# EAGLE design USB4x3HUB (EAGLE 7.5.0)

## Sheet 1 of 2: main
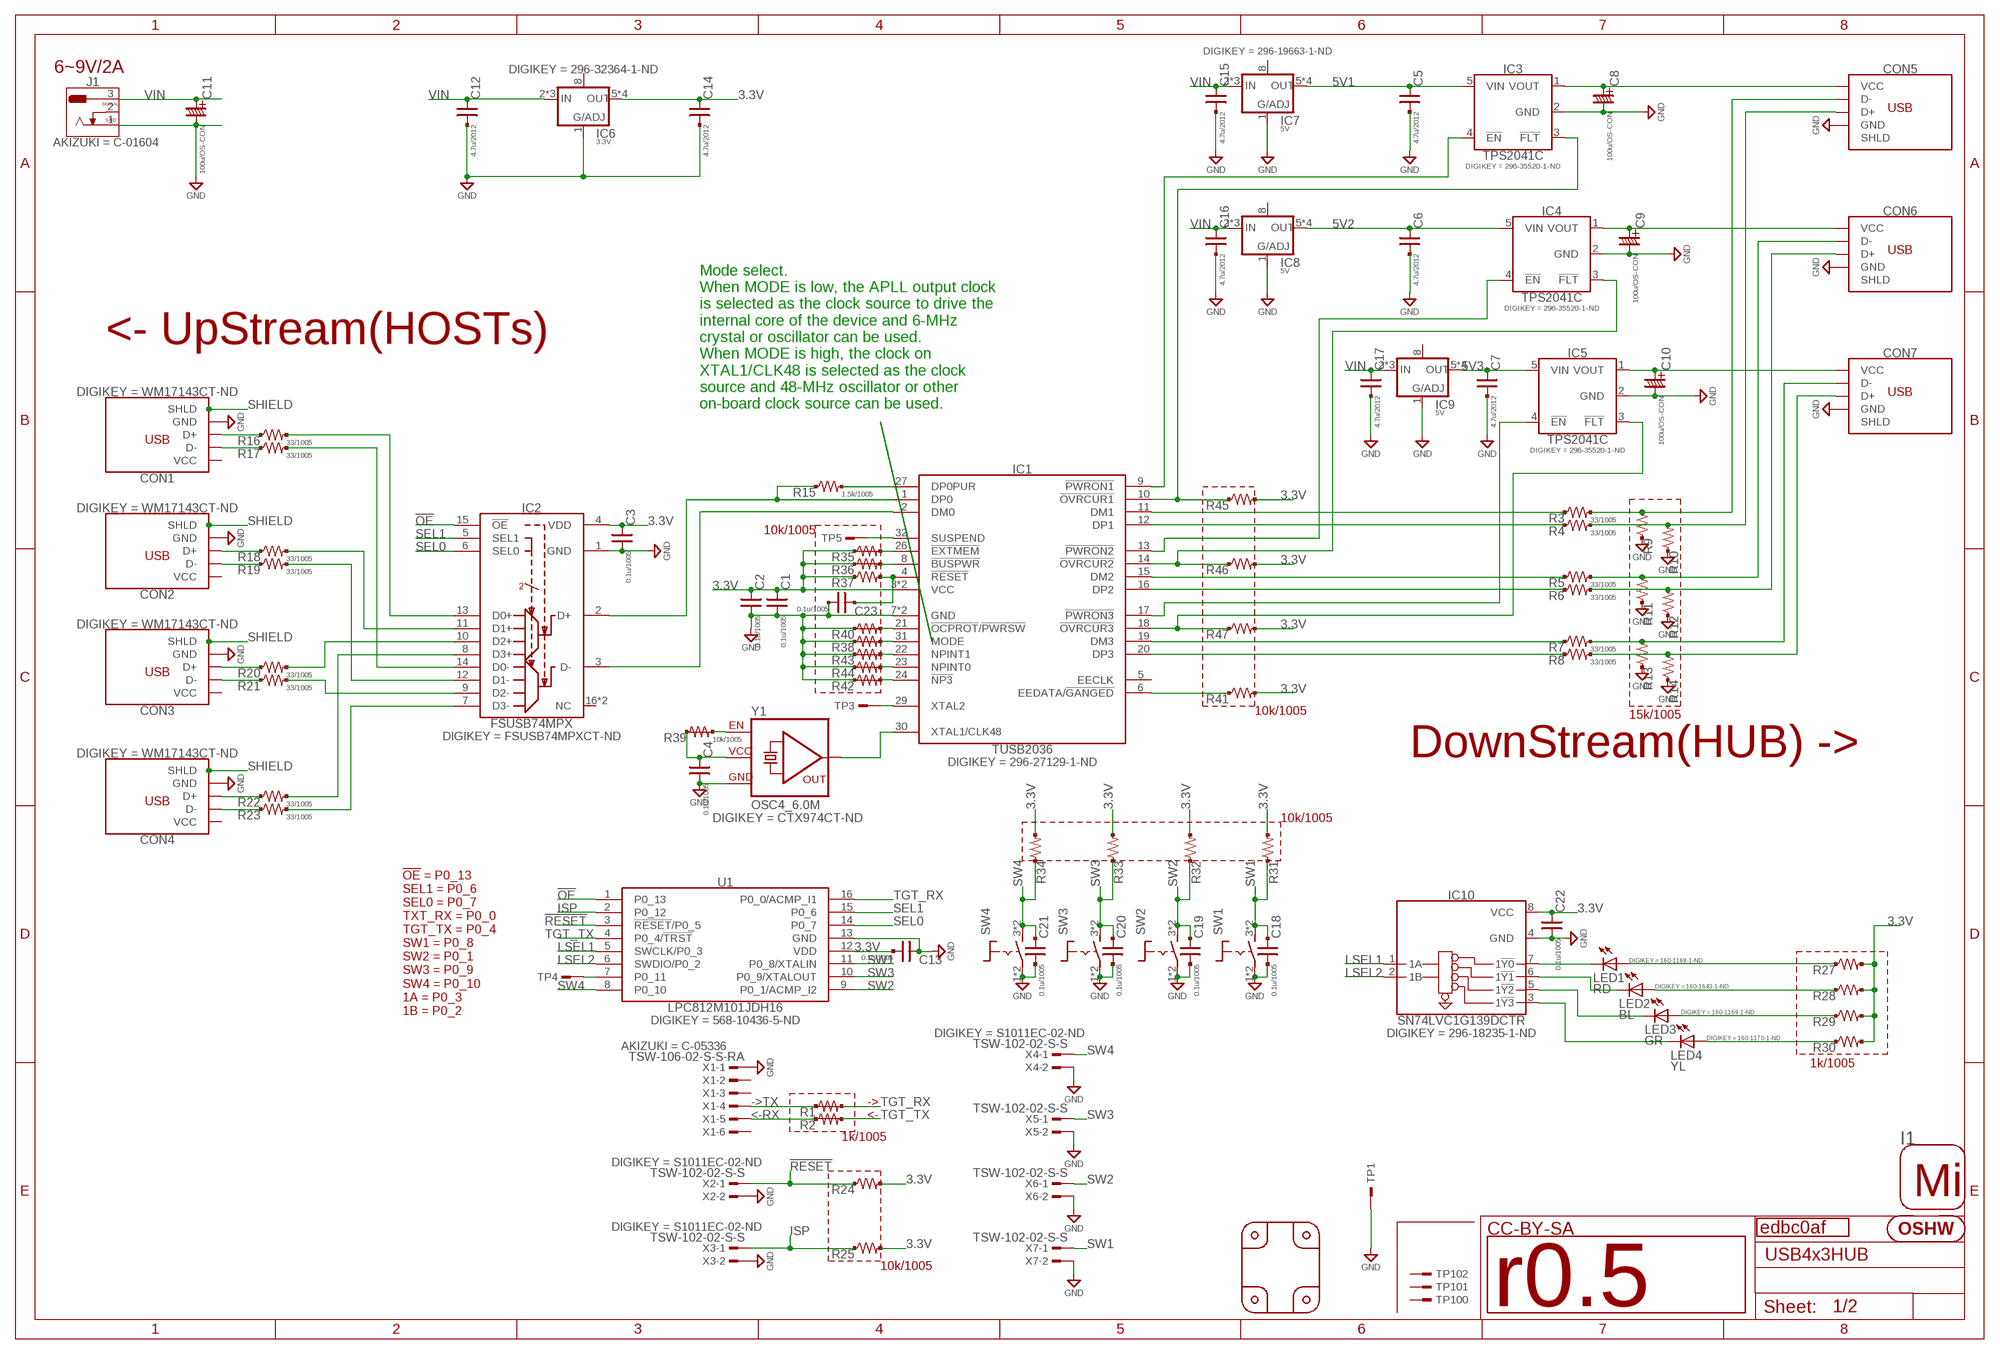
[diagram p0: schematic, sheet 1]

### Parts
C1  0.1u/1005  C_SMD_0.1U_1005  [C0402]
C2  0.1u/1005  C_SMD_0.1U_1005  [C0402]
C3  0.1u/1005  C_SMD_0.1U_1005  [C0402]
C4  0.1u/1005  C_SMD_0.1U_1005  [C0402]
C5  4.7u/2012  C_SMD_4.7U_2012  [CR_2125]
C6  4.7u/2012  C_SMD_4.7U_2012  [CR_2125]
C7  4.7u/2012  C_SMD_4.7U_2012  [CR_2125]
C8  100u/OS-CON  C_DENKAI_100U_875105142005WURTH  [C_2.5PHI5_875105142005WURTH]
C9  100u/OS-CON  C_DENKAI_100U_875105142005WURTH  [C_2.5PHI5_875105142005WURTH]
C10  100u/OS-CON  C_DENKAI_100U_875105142005WURTH  [C_2.5PHI5_875105142005WURTH]
C11  100u/OS-CON  C_DENKAI_100U_2.5P6.3_C6  [C_2.5PHI6.3_C6]
C12  4.7u/2012  C_SMD_4.7U_2012  [CR_2125]
C13  0.1u/1005  C_SMD_0.1U_1005  [C0402]
C14  4.7u/2012  C_SMD_4.7U_2012  [CR_2125]
C15  4.7u/2012  C_SMD_4.7U_2012  [CR_2125]
C16  4.7u/2012  C_SMD_4.7U_2012  [CR_2125]
C17  4.7u/2012  C_SMD_4.7U_2012  [CR_2125]
C18  0.1u/1005  C_SMD_0.1U_1005  [C0402]
C19  0.1u/1005  C_SMD_0.1U_1005  [C0402]
C20  0.1u/1005  C_SMD_0.1U_1005  [C0402]
C21  0.1u/1005  C_SMD_0.1U_1005  [C0402]
C22  0.1u/1005  C_SMD_0.1U_1005  [C0402]
C23  0.1u/1005  C_SMD_0.1U_1005  [C0402]
CON1  CON_USB_UB  [CON_USB_47589-0001MOLEX]
CON2  CON_USB_UB  [CON_USB_47589-0001MOLEX]
CON3  CON_USB_UB  [CON_USB_47589-0001MOLEX]
CON4  CON_USB_UB  [CON_USB_47589-0001MOLEX]
CON5  CON_USB_A_614104150121  [CON_USB_614104150121WURTH]
CON6  CON_USB_A_614104150121  [CON_USB_614104150121WURTH]
CON7  CON_USB_A_614104150121  [CON_USB_614104150121WURTH]
GIT1  edbc0af  GIT-REVISION_1.0  [GIT-REVISION]
I1  ICON_MINLAB_5.2S  [ICON_MINLAB_5.2MM]
IC1  TUSB2036  IC_USB_TUSB2036  [QFP32_0.8P7.2X7.2]
IC2  FSUSB74MPX  IC_USB_FSUSB74  [QFN16_0.5P3.0X3.0]
IC3  TPS2041C  IC_POWER_TPS2041C  [IC_05_0.95_50MIL]
IC4  TPS2041C  IC_POWER_TPS2041C  [IC_05_0.95_50MIL]
IC5  TPS2041C  IC_POWER_TPS2041C  [IC_05_0.95_50MIL]
IC6  3.3V  LDO4_3.3_DRJ  [DFN80P410X410_8N]
IC7  5V  LDO4_5.0_DRJ  [DFN80P410X410_8N]
IC8  5V  LDO4_5.0_DRJ  [DFN80P410X410_8N]
IC9  5V  LDO4_5.0_DRJ  [DFN80P410X410_8N]
IC10  SN74LVC1G139DCTR  IC_TTL_SINGLE_74_139_FLAT  [SOT65P315X290-8N]
ICON1  OSHW  ICON_OSHW  [ICON_OSHW]
ICON2  r0.5  ICON_REVISION_2.0  [ICON_REVISION2.0]
J1  CON_DCJACK_C1604  [CON_DCJACK_C-1604]
LED1  RD  LEDRDCHIPLED_0805  [CHIPLED_0805]
LED2  BL  LEDBLCHIPLED_0805  [CHIPLED_0805]
LED3  GR  LEDGRCHIPLED_0805  [CHIPLED_0805]
LED4  YL  LEDYLCHIPLED_0805  [CHIPLED_0805]
P1  PCB_CORNER  [PCB_CORNER]
P2  PCB_CORNER  [PCB_CORNER]
P3  PCB_CORNER  [PCB_CORNER]
P4  PCB_CORNER  [PCB_CORNER]
R1  R_US__1005SHORT  [R0402SHORT]
R2  R_US__1005SHORT  [R0402SHORT]
R3  33/1005  R_US_33R_1005  [C0402]
R4  33/1005  R_US_33R_1005  [C0402]
R5  33/1005  R_US_33R_1005  [C0402]
R6  33/1005  R_US_33R_1005  [C0402]
R7  33/1005  R_US_33R_1005  [C0402]
R8  33/1005  R_US_33R_1005  [C0402]
R9  15k/1005  R_US_15K_1005  [C0402]
R10  15k/1005  R_US_15K_1005  [C0402]
R11  15k/1005  R_US_15K_1005  [C0402]
R12  15k/1005  R_US_15K_1005  [C0402]
R13  15k/1005  R_US_15K_1005  [C0402]
R14  15k/1005  R_US_15K_1005  [C0402]
R15  1.5k/1005  R_US_1.5K_1005  [C0402]
R16  33/1005  R_US_33R_1005  [C0402]
R17  33/1005  R_US_33R_1005  [C0402]
R18  33/1005  R_US_33R_1005  [C0402]
R19  33/1005  R_US_33R_1005  [C0402]
R20  33/1005  R_US_33R_1005  [C0402]
R21  33/1005  R_US_33R_1005  [C0402]
R22  33/1005  R_US_33R_1005  [C0402]
R23  33/1005  R_US_33R_1005  [C0402]
R24  10k/1005  R_US_10K_1005  [C0402]
R25  10k/1005  R_US_10K_1005  [C0402]
R27  1k/1005  R_US_1.0K_1005  [C0402]
R28  1k/1005  R_US_1.0K_1005  [C0402]
R29  1k/1005  R_US_1.0K_1005  [C0402]
R30  1k/1005  R_US_1.0K_1005  [C0402]
R31  10k/1005  R_US_10K_1005  [C0402]
R32  10k/1005  R_US_10K_1005  [C0402]
R33  10k/1005  R_US_10K_1005  [C0402]
R34  10k/1005  R_US_10K_1005  [C0402]
R35  R_US__1005SHORT  [R0402SHORT]
R36  R_US__1005SHORT  [R0402SHORT]
R37  10k/1005  R_US_10K_1005  [C0402]
R38  R_US__1005SHORT  [R0402SHORT]
R39  10k/1005  R_US__1005SHORT  [R0402SHORT]
R40  R_US__1005SHORT  [R0402SHORT]
R41  10k/1005  R_US_10K_1005  [C0402]
R42  R_US__1005SHORT  [R0402SHORT]
R43  R_US__1005SHORT  [R0402SHORT]
R44  R_US__1005SHORT  [R0402SHORT]
R45  10k/1005  R_US_10K_1005  [C0402]
R46  10k/1005  R_US_10K_1005  [C0402]
R47  10k/1005  R_US_10K_1005  [C0402]
SW1  TACTSW2_WH_SKRPACE010  [SW_TACTSW_SKRPACE010]
SW2  TACTSW2_WH_SKRPACE010  [SW_TACTSW_SKRPACE010]
SW3  TACTSW2_WH_SKRPACE010  [SW_TACTSW_SKRPACE010]
SW4  TACTSW2_WH_SKRPACE010  [SW_TACTSW_SKRPACE010]
TP1  TESTPAD_4020  [TP_4020]
TP3  TESTPAD  [TP06RECT]
TP4  TESTPAD  [TP06RECT]
TP5  TESTPAD  [TP06RECT]
TP100  TESTPAD_F  [FIDUCIAL]
TP101  TESTPAD_F  [FIDUCIAL]
TP102  TESTPAD_F  [FIDUCIAL]
U1  LPC812M101JDH16  IC_LPC81X_16_JDH16  [SOT65P510X450X110-16N]
X1  TSW-106-02-S-S-RA  [TSW-106-02-S-S-RA]
X2  TSW-102-02-S-S  [TSW-102-02-S-S]
X3  TSW-102-02-S-S  [TSW-102-02-S-S]
X4  TSW-102-02-S-S  [TSW-102-02-S-S]
X5  TSW-102-02-S-S  [TSW-102-02-S-S]
X6  TSW-102-02-S-S  [TSW-102-02-S-S]
X7  TSW-102-02-S-S  [TSW-102-02-S-S]
Y1  OSC4_6.0M  [CLOCK_2520]

### Nets
3.3V: C1.1 C2.1 C3.1 C4.1 C13.2 C14.1 C22.1 IC1.3(VCC) IC1.25(VCC) IC2.4(VDD) IC6.5(OUT) IC6.6(OUT) IC6.7(OUT) IC6.EP(OUT) IC10.8(VCC) R24.2 R25.2 R27.2 R28.2 R29.2 R30.2 R31.2 R32.2 R33.2 R34.2 R35.1 R35.2 R36.1 R36.2 R37.1 R39.1 R39.2 R41.2 R45.2 R46.2 R47.2 U1.12(VDD) Y1.4(VCC)
5V1: C5.1 IC3.5(VIN) IC7.5(OUT) IC7.6(OUT) IC7.7(OUT) IC7.EP(OUT)
5V2: C6.1 IC4.5(VIN) IC8.5(OUT) IC8.6(OUT) IC8.7(OUT) IC8.EP(OUT)
5V3: C7.1 IC5.5(VIN) IC9.5(OUT) IC9.6(OUT) IC9.7(OUT) IC9.EP(OUT)
!OE!: IC2.15(!OE!) U1.1(P0_13)
!RESET!: R24.1 U1.3(!RESET!/P0_5) X2.1
->TX: R1.1 R1.2 X1.4
<-RX: R2.1 R2.2 X1.5
GND: C1.2 C2.2 C3.2 C4.2 C5.2 C6.2 C7.2 C8.- C9.- C10.- C11.- C12.2 C13.1 C14.2 C15.2 C16.2 C17.2 C18.2 C19.2 C20.2 C21.2 C22.2 C23.2 CON1.5(GND) CON2.5(GND) CON3.5(GND) CON4.5(GND) CON5.4(GND) CON6.4(GND) CON7.4(GND) IC1.7(GND) IC1.28(GND) IC2.1(GND) IC3.2(GND) IC4.2(GND) IC5.2(GND) IC6.1(ADJ) IC7.1(ADJ) IC8.1(ADJ) IC9.1(ADJ) IC10.4(GND) J1.1 R9.1 R10.1 R11.1 R12.1 R13.1 R14.1 R38.1 R38.2 R40.1 R40.2 R42.1 R42.2 R43.1 R43.2 R44.1 R44.2 SW1.1(P) SW1.2(P) SW2.1(P) SW2.2(P) SW3.1(P) SW3.2(P) SW4.1(P) SW4.2(P) TP1.TP U1.13(GND) X1.1 X2.2 X3.2 X4.2 X5.2 X6.2 X7.2 Y1.2(GND)
ISP: R25.1 U1.2(P0_12) X3.1
LSEL1: IC10.1(1A) U1.5(SWCLK/P0_3)
LSEL2: IC10.2(1B) U1.6(SWDIO/P0_2)
N$1: IC1.1(DP0) IC2.2(D+) R15.1
N$2: IC1.2(DM0) IC2.3(D-)
N$3: CON1.3(D+) R16.1
N$4: CON1.2(D-) R17.1
N$5: CON2.3(D+) R18.1
N$6: CON2.2(D-) R19.1
N$7: CON3.3(D+) R20.1
N$8: CON4.3(D+) R22.1
N$9: CON3.2(D-) R21.1
N$10: CON4.2(D-) R23.1
N$11: C8.+ CON5.1(VCC) IC3.1(VOUT)
N$12: C9.+ CON6.1(VCC) IC4.1(VOUT)
N$13: C10.+ CON7.1(VCC) IC5.1(VOUT)
N$14: CON1.1(VCC)
N$15: IC1.30(XTAL1/CLK48) Y1.3(OUT)
N$16: IC1.10(!OVRCUR1!) IC3.3(!FLT!) R45.1
N$17: IC1.9(!PWRON1!) IC3.4(!EN!)
N$18: CON5.2(D-) R3.2 R9.2
N$19: CON5.3(D+) R4.2 R10.2
N$20: IC1.14(!OVRCUR2!) IC4.3(!FLT!) R46.1
N$21: IC1.13(!PWRON2!) IC4.4(!EN!)
N$22: CON6.2(D-) R5.2 R11.2
N$23: CON6.3(D+) R6.2 R12.2
N$24: IC1.17(!PWRON3!) IC5.4(!EN!)
N$25: IC1.18(!OVRCUR3!) IC5.3(!FLT!) R47.1
N$26: CON7.2(D-) R7.2 R13.2
N$27: CON7.3(D+) R8.2 R14.2
N$28: CON2.1(VCC)
N$29: CON3.1(VCC)
N$30: IC1.6(EEDATA/!GANGED!) R41.1
N$35: IC1.11(DM1) R3.1
N$36: IC1.12(DP1) R4.1
N$37: IC1.15(DM2) R5.1
N$38: IC1.16(DP2) R6.1
N$39: IC1.19(DM3) R7.1
N$40: IC1.20(DP3) R8.1
N$41: IC1.27(DP0PUR) R15.2
N$42: IC2.13(D0+) R16.2
N$43: IC2.11(D1+) R18.2
N$44: IC2.10(D2+) R20.2
N$45: IC2.8(D3+) R22.2
N$46: IC2.14(D0-) R17.2
N$47: IC2.12(D1-) R19.2
N$48: IC2.9(D2-) R21.2
N$49: IC2.7(D3-) R23.2
N$50: IC1.32(SUSPEND) TP5.TP
N$51: IC10.7(1!Y0!) LED1.C
N$52: IC10.6(1!Y1!) LED2.C
N$53: IC10.5(1!Y2!) LED3.C
N$54: IC10.3(1!Y3!) LED4.C
N$55: LED4.A R30.1
N$56: LED3.A R29.1
N$57: LED2.A R28.1
N$58: LED1.A R27.1
N$59: IC1.29(XTAL2) TP3.TP
N$60: IC1.26(!EXTMEM!) R35.3
N$61: IC1.8(!BUSPWR!) R36.3
N$62: C23.1 IC1.4(!RESET!) R37.2
N$63: IC1.21(!OCPROT!/!PWRSW!) R40.3
N$64: IC1.31(MODE) R38.3
N$65: IC1.22(NPINT1) R43.3
N$66: IC1.23(NPINT0) R44.3
N$67: IC1.24(!NP3!) R42.3
N$68: R39.3 Y1.1(C)
N$69: TP4.TP U1.7(P0_11)
SEL0: IC2.6(SEL0) U1.14(P0_7)
SEL1: IC2.5(SEL1) U1.15(P0_6)
SHIELD: CON1.SHD$1(SHLD) CON1.SHD$2(SHLD) CON1.SHD$3(SHLD) CON1.SHD$4(SHLD) CON1.SHD$5(SHLD) CON1.SHD$6(SHLD) CON1.SHD$7(SHLD) CON1.SHD(SHLD) CON2.SHD$1(SHLD) CON2.SHD$2(SHLD) CON2.SHD$3(SHLD) CON2.SHD$4(SHLD) CON2.SHD$5(SHLD) CON2.SHD$6(SHLD) CON2.SHD$7(SHLD) CON2.SHD(SHLD) CON3.SHD$1(SHLD) CON3.SHD$2(SHLD) CON3.SHD$3(SHLD) CON3.SHD$4(SHLD) CON3.SHD$5(SHLD) CON3.SHD$6(SHLD) CON3.SHD$7(SHLD) CON3.SHD(SHLD) CON4.SHD$1(SHLD) CON4.SHD$2(SHLD) CON4.SHD$3(SHLD) CON4.SHD$4(SHLD) CON4.SHD$5(SHLD) CON4.SHD$6(SHLD) CON4.SHD$7(SHLD) CON4.SHD(SHLD)
SW1: C18.1 R31.1 SW1.3(S) SW1.4(S) U1.11(P0_8/XTALIN) X7.1
SW2: C19.1 R32.1 SW2.3(S) SW2.4(S) U1.9(P0_1/ACMP_I2) X6.1
SW3: C20.1 R33.1 SW3.3(S) SW3.4(S) U1.10(P0_9/XTALOUT) X5.1
SW4: C21.1 R34.1 SW4.3(S) SW4.4(S) U1.8(P0_10) X4.1
TGT_RX: R1.3 U1.16(P0_0/ACMP_I1)
TGT_TX: R2.3 U1.4(P0_4/!TRST!)
VIN: C11.+ C12.1 C15.1 C16.1 C17.1 IC6.2(IN) IC6.3(IN) IC6.4(IN) IC7.2(IN) IC7.3(IN) IC7.4(IN) IC8.2(IN) IC8.3(IN) IC8.4(IN) IC9.2(IN) IC9.3(IN) IC9.4(IN) J1.3
Unconnected: CON5.SHLD CON5.SHLD@1(SHLD) CON6.SHLD CON6.SHLD@1(SHLD) CON7.SHLD CON7.SHLD@1(SHLD) IC1.5(EECLK) IC2.16(NC) IC2.DP(NC) IC6.8(OUT/EN/NC) IC7.8(OUT/EN/NC) IC8.8(OUT/EN/NC) IC9.8(OUT/EN/NC) J1.2 TP100.TP TP101.TP TP102.TP X1.2 X1.3 X1.6

### Notes on the sheet
- 6~9V/2A
- <- UpStream(HOSTs)
- Mode select. 
  When MODE is low, the APLL output clock 
  is selected as the clock source to drive the
  internal core of the device and 6-MHz 
  crystal or oscillator can be used. 
  When MODE is high, the clock on 
  XTAL1/CLK48 is selected as the clock
  source and 48-MHz oscillator or other 
  on-board clock source can be used.
- 10k/1005
- 10k/1005
- 15k/1005
- DownStream(HUB) ->
- 10k/1005
- !OE! = P0_13
  SEL1 = P0_6
  SEL0 = P0_7
  TXT_RX = P0_0
  TGT_TX = P0_4
  SW1 = P0_8
  SW2 = P0_1
  SW3 = P0_9
  SW4 = P0_10
  1A = P0_3
  1B = P0_2
- 1k/1005
- ->
- <-
- 1k/1005
- CC-BY-SA
- 10k/1005

## Sheet 2 of 2
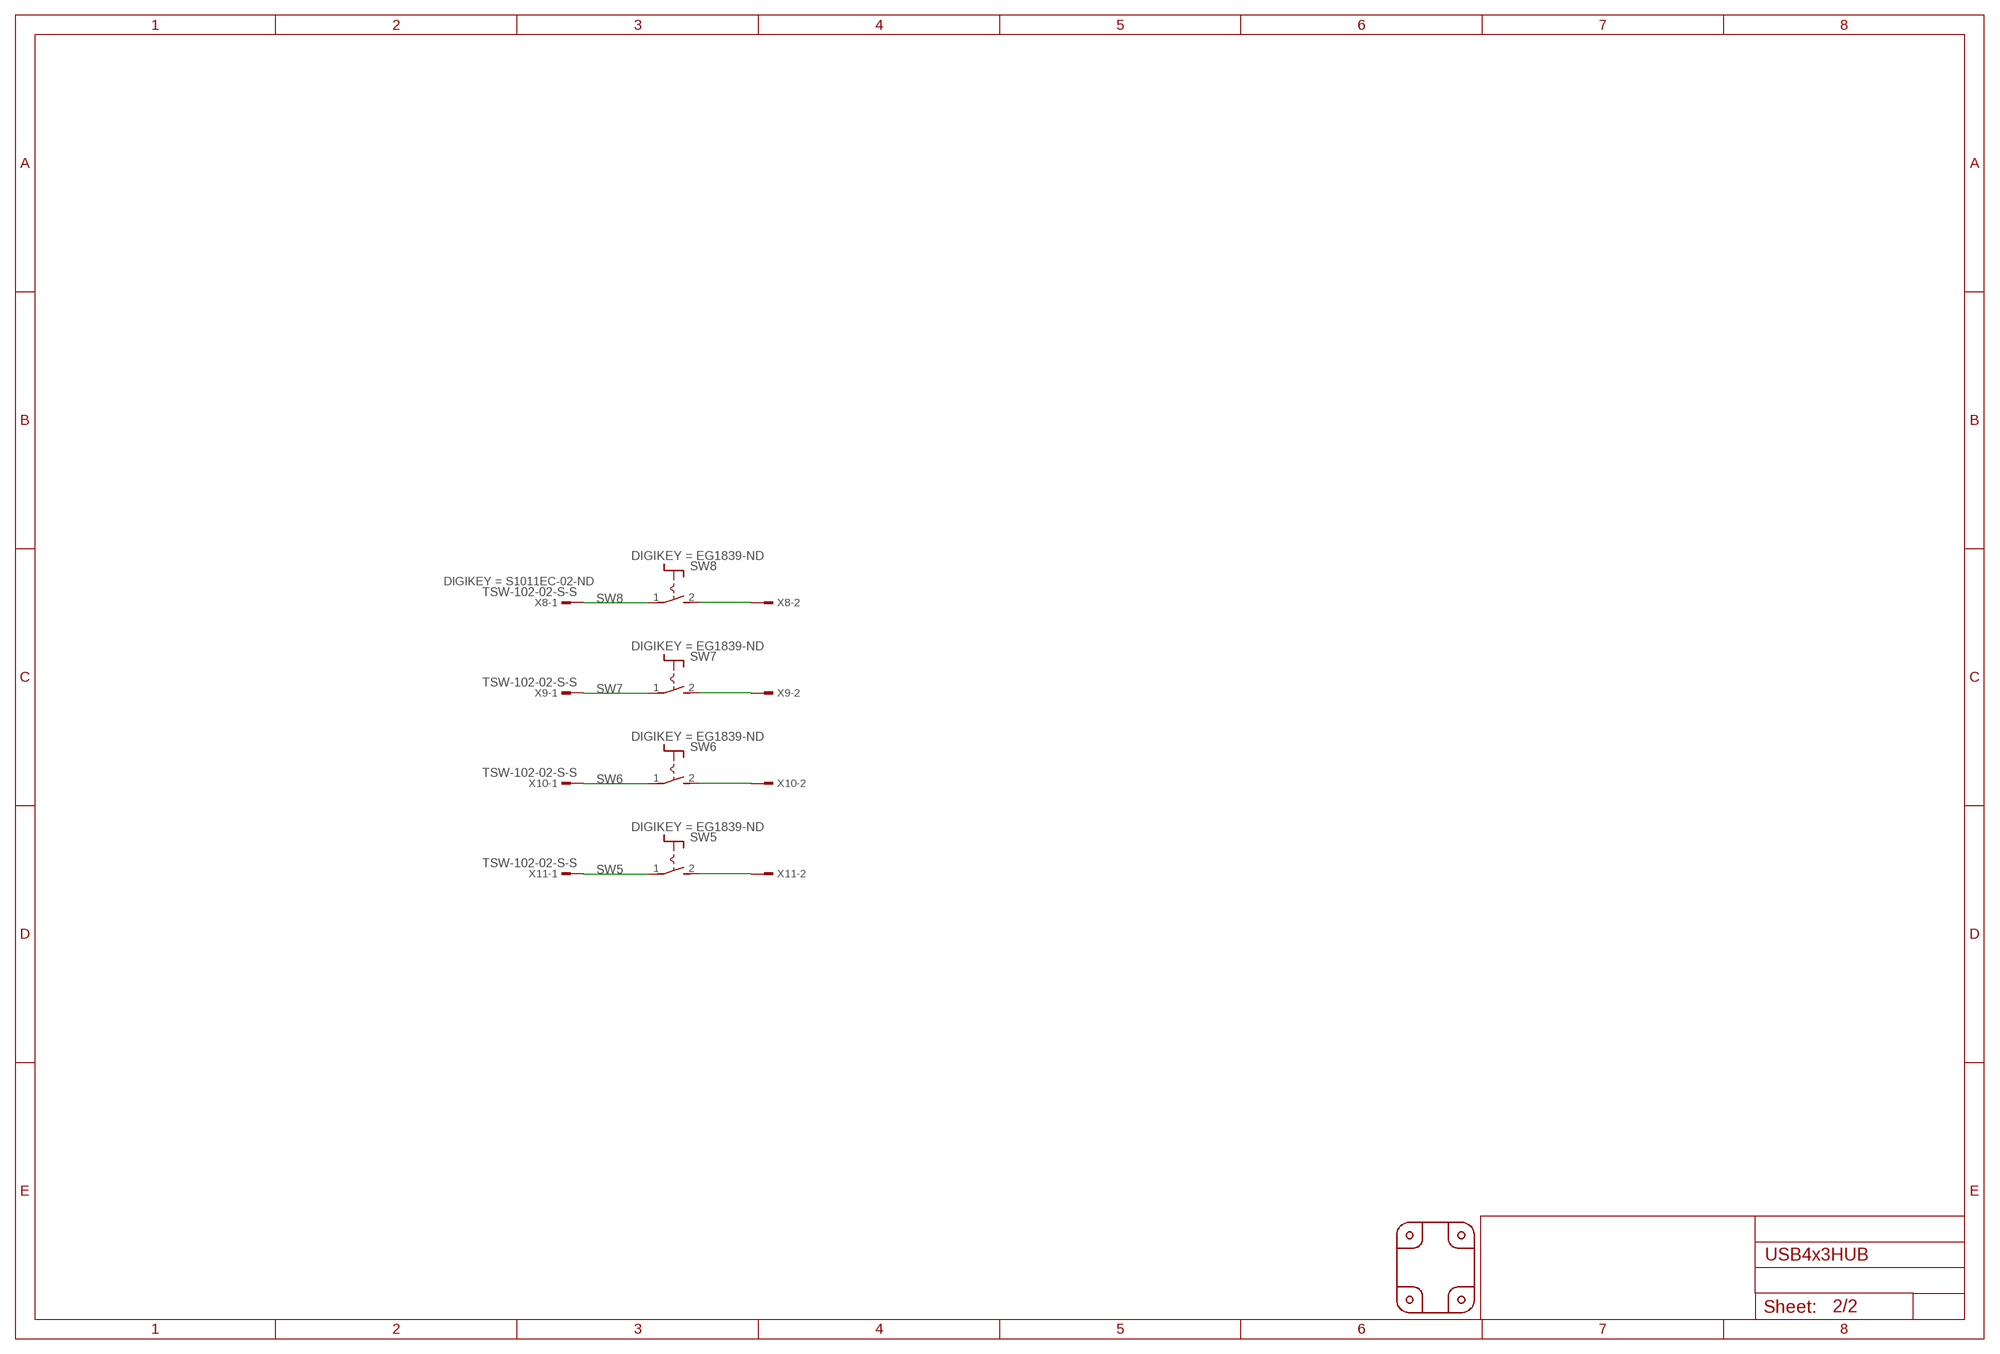
[diagram p1: schematic, sheet 2]

### Parts
P5  PCB_CORNER  [PCB_CORNER]
P6  PCB_CORNER  [PCB_CORNER]
P7  PCB_CORNER_NH  [PCB_CORNER_NH]
P8  PCB_CORNER_NH  [PCB_CORNER_NH]
SW5  TACTSW2_BK_TL1105S  [SW_TACTSW_TL1105S]
SW6  TACTSW2_BK_TL1105S  [SW_TACTSW_TL1105S]
SW7  TACTSW2_BK_TL1105S  [SW_TACTSW_TL1105S]
SW8  TACTSW2_BK_TL1105S  [SW_TACTSW_TL1105S]
X8  TSW-102-02-S-S  [TSW-102-02-S-S]
X9  TSW-102-02-S-S  [TSW-102-02-S-S]
X10  TSW-102-02-S-S  [TSW-102-02-S-S]
X11  TSW-102-02-S-S  [TSW-102-02-S-S]

### Nets
N$74: SW8.2(S) X8.2
N$75: SW7.2(S) X9.2
N$76: SW6.2(S) X10.2
N$77: SW5.2(S) X11.2
SW5: SW5.1(P) X11.1
SW6: SW6.1(P) X10.1
SW7: SW7.1(P) X9.1
SW8: SW8.1(P) X8.1

## Power pins joined to a net without a drawn wire
VCC: CON4.1(VCC)

## Library data of the parts
C1-C4 C13 C18-C23 = mylib:C_SMD_*: SMD CAPACITOR; DIGIKEY: 490-3261-1-ND; SEEED: 302010024; SMD_PAD: 2
C5-C7 C12 C14-C17 = mylib:C_SMD_*: SMD CAPACITOR; DIGIKEY: 490-9962-1-ND; SMD_PAD: 2
C8-C10 = mylib:C_DENKAI_*: Chemical capacitor; DIGIKEY: 732-6394-1-ND; SMD_PAD: 2
C11 = mylib:C_DENKAI_*: Chemical capacitor; DIGIKEY: P16468CT-ND; SMD_PAD: 2
CON1-CON4 = mylib:CON_USB: USB B CONNECTOR; DIGIKEY: WM17143CT-ND; SMD_PAD: 11
CON5-CON7 = mylib:CON_USB: USB B CONNECTOR; DIGIKEY: 732-5962-1-ND; MOUSER: 710-614104150121; TH_PAD: 6
GIT1 = git-revision:GIT-REVISION; NOT_COMPONENT: YES
I1 = mylib:ICON_MINLAB; NOT_COMPONENT: YES
IC1 = mylib:IC_USB_TUSB2036: 2/3-port USB hub IC; DIGIKEY: 296-27129-1-ND; SMD_PAD: 32
IC2 = mylib:IC_USB_FSUSB74: 4 to 1 USB switch; DIGIKEY: FSUSB74MPXCT-ND; SMD_PAD: 17
IC3-IC5 = mylib:IC_POWER_TPS2041C: power switch; DIGIKEY: 296-35520-1-ND; SMD_PAD: 5
IC6 = mylib:LDO4_*: LDO with 4 pins; DIGIKEY: 296-32364-1-ND; SMD_PAD: 9
IC7-IC9 = mylib:LDO4_*: LDO with 4 pins; DIGIKEY: 296-19663-1-ND; MOUSER: 595-TLV1117-50CDRJR; SMD_PAD: 9
IC10 = mylib:IC_TTL_SINGLE_74_139: single 74 logic IC: 139; DIGIKEY: 296-18235-1-ND; SMD_PAD: 8
ICON1 = mylib:ICON_OSHW: Silk icon of OSHW; NOT_COMPONENT: YES
ICON2 = mylib:ICON_REVISION; NOT_COMPONENT: YES
J1 = mylib:CON_DCJACK: DC JACK : 2.1 / 2.5 mm; AKIZUKI: C-01604; MOUSER: 163-179PH-EX; SEEED: 320120003; TH_PAD: 3
LED1 = led_local:LED: LED OSRAM: - CHIPLED LG R971, LG N971, LY N971, LG Q971, LY Q971, LO R971, LY R971 LH N974, LH R974 LS Q976, LO Q976, LY Q976 LO Q996 - Hyper CHIPLED LW Q18S LB Q993, LB Q99A, LB R99A - SideLED LS A670, LO A670, LY A670, LG A670, LP A670 LB A673, LV A673, LT A673, LW A673 LH A674 LY A675 LS A676, LA A676, LO A676, LY A676, LW A676 LS A679, LY A679, LG A679 - Hyper Micro SIDELED® LS Y876, LA Y876, LO Y876, LY Y876 LT Y87S - SmartLED LW L88C, LW L88S LB L89C, LB L89S, LG L890 LS L89K, LO L89K, LY L89K LS L896, LA L896, LO L896, LY L896 - TOPLED LS T670, LO T670, LY T670, LG T670, LP T670 LSG T670, LSP T670, LSY T670, LOP T670, LYG T670 LG T671, LOG T671, LSG T671 LB T673, LV T673, LT T673, LW T673 LH T674 LS T676, LA T676, LO T676, LY T676, LB T676, LH T676, LSB T676, LW T676 LB T67C, LV T67C, LT T67C, LS T67K, LO T67K, LY T67K, LW E67C LS E67B, LA E67B, LO E67B, LY E67B, LB E67C, LV E67C, LT E67C LW T67C LS T679, LY T679, LG T679 LS T770, LO T770, LY T770, LG T770, LP T770 LB T773, LV T773, LT T773, LW T773 LH T774 LS E675, LA E675, LY E675, LS T675 LS T776, LA T776, LO T776, LY T776, LB T776 LHGB T686 LT T68C, LB T68C - Hyper Mini TOPLED® LB M676 - Mini TOPLED Santana® LG M470 LS M47K, LO M47K, LY M47K Source: http://www.osram.convergy.de LUXEON: - LUMILED® LXK2-PW12-R00, LXK2-PW12-S00, LXK2-PW14-U00, LXK2-PW14-V00 LXK2-PM12-R00, LXK2-PM12-S00, LXK2-PM14-U00 LXK2-PE12-Q00, LXK2-PE12-R00, LXK2-PE12-S00, LXK2-PE14-T00, LXK2-PE14-U00 LXK2-PB12-K00, LXK2-PB12-L00, LXK2-PB12-M00, LXK2-PB14-N00, LXK2-PB14-P00, LXK2-PB14-Q00 LXK2-PR12-L00, LXK2-PR12-M00, LXK2-PR14-Q00, LXK2-PR14-R00 LXK2-PD12-Q00, LXK2-PD12-R00, LXK2-PD12-S00 LXK2-PH12-R00, LXK2-PH12-S00 LXK2-PL12-P00, LXK2-PL12-Q00, LXK2-PL12-R00 Source: www.luxeon.com KINGBRIGHT: KA-3528ASYC Source: www.kingbright.com; AKIZUKI: I-06419; DIGIKEY: 160-1168-1-ND; SEEED: 304090046; SMD_PAD: 2
LED2 = led_local:LED: LED OSRAM: - CHIPLED LG R971, LG N971, LY N971, LG Q971, LY Q971, LO R971, LY R971 LH N974, LH R974 LS Q976, LO Q976, LY Q976 LO Q996 - Hyper CHIPLED LW Q18S LB Q993, LB Q99A, LB R99A - SideLED LS A670, LO A670, LY A670, LG A670, LP A670 LB A673, LV A673, LT A673, LW A673 LH A674 LY A675 LS A676, LA A676, LO A676, LY A676, LW A676 LS A679, LY A679, LG A679 - Hyper Micro SIDELED® LS Y876, LA Y876, LO Y876, LY Y876 LT Y87S - SmartLED LW L88C, LW L88S LB L89C, LB L89S, LG L890 LS L89K, LO L89K, LY L89K LS L896, LA L896, LO L896, LY L896 - TOPLED LS T670, LO T670, LY T670, LG T670, LP T670 LSG T670, LSP T670, LSY T670, LOP T670, LYG T670 LG T671, LOG T671, LSG T671 LB T673, LV T673, LT T673, LW T673 LH T674 LS T676, LA T676, LO T676, LY T676, LB T676, LH T676, LSB T676, LW T676 LB T67C, LV T67C, LT T67C, LS T67K, LO T67K, LY T67K, LW E67C LS E67B, LA E67B, LO E67B, LY E67B, LB E67C, LV E67C, LT E67C LW T67C LS T679, LY T679, LG T679 LS T770, LO T770, LY T770, LG T770, LP T770 LB T773, LV T773, LT T773, LW T773 LH T774 LS E675, LA E675, LY E675, LS T675 LS T776, LA T776, LO T776, LY T776, LB T776 LHGB T686 LT T68C, LB T68C - Hyper Mini TOPLED® LB M676 - Mini TOPLED Santana® LG M470 LS M47K, LO M47K, LY M47K Source: http://www.osram.convergy.de LUXEON: - LUMILED® LXK2-PW12-R00, LXK2-PW12-S00, LXK2-PW14-U00, LXK2-PW14-V00 LXK2-PM12-R00, LXK2-PM12-S00, LXK2-PM14-U00 LXK2-PE12-Q00, LXK2-PE12-R00, LXK2-PE12-S00, LXK2-PE14-T00, LXK2-PE14-U00 LXK2-PB12-K00, LXK2-PB12-L00, LXK2-PB12-M00, LXK2-PB14-N00, LXK2-PB14-P00, LXK2-PB14-Q00 LXK2-PR12-L00, LXK2-PR12-M00, LXK2-PR14-Q00, LXK2-PR14-R00 LXK2-PD12-Q00, LXK2-PD12-R00, LXK2-PD12-S00 LXK2-PH12-R00, LXK2-PH12-S00 LXK2-PL12-P00, LXK2-PL12-Q00, LXK2-PL12-R00 Source: www.luxeon.com KINGBRIGHT: KA-3528ASYC Source: www.kingbright.com; AKIZUKI: I-06424; DIGIKEY: 160-1643-1-ND; SEEED: 304090061; SMD_PAD: 2
LED3 = led_local:LED: LED OSRAM: - CHIPLED LG R971, LG N971, LY N971, LG Q971, LY Q971, LO R971, LY R971 LH N974, LH R974 LS Q976, LO Q976, LY Q976 LO Q996 - Hyper CHIPLED LW Q18S LB Q993, LB Q99A, LB R99A - SideLED LS A670, LO A670, LY A670, LG A670, LP A670 LB A673, LV A673, LT A673, LW A673 LH A674 LY A675 LS A676, LA A676, LO A676, LY A676, LW A676 LS A679, LY A679, LG A679 - Hyper Micro SIDELED® LS Y876, LA Y876, LO Y876, LY Y876 LT Y87S - SmartLED LW L88C, LW L88S LB L89C, LB L89S, LG L890 LS L89K, LO L89K, LY L89K LS L896, LA L896, LO L896, LY L896 - TOPLED LS T670, LO T670, LY T670, LG T670, LP T670 LSG T670, LSP T670, LSY T670, LOP T670, LYG T670 LG T671, LOG T671, LSG T671 LB T673, LV T673, LT T673, LW T673 LH T674 LS T676, LA T676, LO T676, LY T676, LB T676, LH T676, LSB T676, LW T676 LB T67C, LV T67C, LT T67C, LS T67K, LO T67K, LY T67K, LW E67C LS E67B, LA E67B, LO E67B, LY E67B, LB E67C, LV E67C, LT E67C LW T67C LS T679, LY T679, LG T679 LS T770, LO T770, LY T770, LG T770, LP T770 LB T773, LV T773, LT T773, LW T773 LH T774 LS E675, LA E675, LY E675, LS T675 LS T776, LA T776, LO T776, LY T776, LB T776 LHGB T686 LT T68C, LB T68C - Hyper Mini TOPLED® LB M676 - Mini TOPLED Santana® LG M470 LS M47K, LO M47K, LY M47K Source: http://www.osram.convergy.de LUXEON: - LUMILED® LXK2-PW12-R00, LXK2-PW12-S00, LXK2-PW14-U00, LXK2-PW14-V00 LXK2-PM12-R00, LXK2-PM12-S00, LXK2-PM14-U00 LXK2-PE12-Q00, LXK2-PE12-R00, LXK2-PE12-S00, LXK2-PE14-T00, LXK2-PE14-U00 LXK2-PB12-K00, LXK2-PB12-L00, LXK2-PB12-M00, LXK2-PB14-N00, LXK2-PB14-P00, LXK2-PB14-Q00 LXK2-PR12-L00, LXK2-PR12-M00, LXK2-PR14-Q00, LXK2-PR14-R00 LXK2-PD12-Q00, LXK2-PD12-R00, LXK2-PD12-S00 LXK2-PH12-R00, LXK2-PH12-S00 LXK2-PL12-P00, LXK2-PL12-Q00, LXK2-PL12-R00 Source: www.luxeon.com KINGBRIGHT: KA-3528ASYC Source: www.kingbright.com; AKIZUKI: I-06423; DIGIKEY: 160-1169-1-ND; SEEED: 304090057; SMD_PAD: 2
LED4 = led_local:LED: LED OSRAM: - CHIPLED LG R971, LG N971, LY N971, LG Q971, LY Q971, LO R971, LY R971 LH N974, LH R974 LS Q976, LO Q976, LY Q976 LO Q996 - Hyper CHIPLED LW Q18S LB Q993, LB Q99A, LB R99A - SideLED LS A670, LO A670, LY A670, LG A670, LP A670 LB A673, LV A673, LT A673, LW A673 LH A674 LY A675 LS A676, LA A676, LO A676, LY A676, LW A676 LS A679, LY A679, LG A679 - Hyper Micro SIDELED® LS Y876, LA Y876, LO Y876, LY Y876 LT Y87S - SmartLED LW L88C, LW L88S LB L89C, LB L89S, LG L890 LS L89K, LO L89K, LY L89K LS L896, LA L896, LO L896, LY L896 - TOPLED LS T670, LO T670, LY T670, LG T670, LP T670 LSG T670, LSP T670, LSY T670, LOP T670, LYG T670 LG T671, LOG T671, LSG T671 LB T673, LV T673, LT T673, LW T673 LH T674 LS T676, LA T676, LO T676, LY T676, LB T676, LH T676, LSB T676, LW T676 LB T67C, LV T67C, LT T67C, LS T67K, LO T67K, LY T67K, LW E67C LS E67B, LA E67B, LO E67B, LY E67B, LB E67C, LV E67C, LT E67C LW T67C LS T679, LY T679, LG T679 LS T770, LO T770, LY T770, LG T770, LP T770 LB T773, LV T773, LT T773, LW T773 LH T774 LS E675, LA E675, LY E675, LS T675 LS T776, LA T776, LO T776, LY T776, LB T776 LHGB T686 LT T68C, LB T68C - Hyper Mini TOPLED® LB M676 - Mini TOPLED Santana® LG M470 LS M47K, LO M47K, LY M47K Source: http://www.osram.convergy.de LUXEON: - LUMILED® LXK2-PW12-R00, LXK2-PW12-S00, LXK2-PW14-U00, LXK2-PW14-V00 LXK2-PM12-R00, LXK2-PM12-S00, LXK2-PM14-U00 LXK2-PE12-Q00, LXK2-PE12-R00, LXK2-PE12-S00, LXK2-PE14-T00, LXK2-PE14-U00 LXK2-PB12-K00, LXK2-PB12-L00, LXK2-PB12-M00, LXK2-PB14-N00, LXK2-PB14-P00, LXK2-PB14-Q00 LXK2-PR12-L00, LXK2-PR12-M00, LXK2-PR14-Q00, LXK2-PR14-R00 LXK2-PD12-Q00, LXK2-PD12-R00, LXK2-PD12-S00 LXK2-PH12-R00, LXK2-PH12-S00 LXK2-PL12-P00, LXK2-PL12-Q00, LXK2-PL12-R00 Source: www.luxeon.com KINGBRIGHT: KA-3528ASYC Source: www.kingbright.com; AKIZUKI: I-06420; DIGIKEY: 160-1170-1-ND; SEEED: 304090039; SMD_PAD: 2
P1-P8 = mylib:PCB_CORNER; NOT_COMPONENT: YES
R1 R2 R35 R36 R38-R40 R42-R44 = mylib:R_US_*: SMD resistor Packages : _1608 : 1.6 x 0.8 mm _2125 : 2.0 x 1.25 mm _3216 : 3.2 x 1.6 mm; NOT_COMPONENT: YES
R3-R8 R16-R23 = mylib:R_US_*: SMD resistor Packages : _1608 : 1.6 x 0.8 mm _2125 : 2.0 x 1.25 mm _3216 : 3.2 x 1.6 mm; DIGIKEY: P33.0LCT-ND; SEEED: 301010609; SMD_PAD: 2
R9-R14 = mylib:R_US_*: SMD resistor Packages : _1608 : 1.6 x 0.8 mm _2125 : 2.0 x 1.25 mm _3216 : 3.2 x 1.6 mm; DIGIKEY: P15.0KLCT-ND; SEEED: 301010042; SMD_PAD: 2
R15 = mylib:R_US_*: SMD resistor Packages : _1608 : 1.6 x 0.8 mm _2125 : 2.0 x 1.25 mm _3216 : 3.2 x 1.6 mm; DIGIKEY: P1.50KLCT-ND; SEEED: 301010001; SMD_PAD: 2
R24 R25 R31-R34 R37 R41 R45-R47 = mylib:R_US_*: SMD resistor Packages : _1608 : 1.6 x 0.8 mm _2125 : 2.0 x 1.25 mm _3216 : 3.2 x 1.6 mm; DIGIKEY: P10.0KLCT-ND; SEEED: 301010047; SMD_PAD: 2
R27-R30 = mylib:R_US_*: SMD resistor Packages : _1608 : 1.6 x 0.8 mm _2125 : 2.0 x 1.25 mm _3216 : 3.2 x 1.6 mm; DIGIKEY: P1.00KLCT-ND; SEEED: 301010006; SMD_PAD: 2
SW1-SW4 = mylib:TACTSW2_*: 2P tact switch; AKIZUKI: P-06185; MOUSER: 688-SKRPAC; NOT_COMPONENT: YES
SW5-SW8 = mylib:TACTSW2_*: 2P tact switch; DIGIKEY: EG1839-ND; MOUSER: EG1839-ND
TP1 = mylib:TESTPAD: test points; DIGIKEY: 36-5019CT-ND; SMD_PAD: 1
TP3-TP5 TP100-TP102 = mylib:TESTPAD: test points; NOT_COMPONENT: YES
U1 = mylib:IC_LPC81X_16: LPC81X microcontroller; DIGIKEY: 568-10436-5-ND; SMD_PAD: 16
X1 = con-samtec.local:TSW-106-02-S-S: THROUGH-HOLE HEADER Source: Samtec TSW.pdf; AKIZUKI: C-05336; DIGIKEY: 952-2372-ND; SEEED: 320020019; TH_PAD: 6
X2-X11 = con-samtec.local:TSW-102-02-S-S: THROUGH-HOLE POST HEADER Source: Samtec TSW.pdf; AKIZUKI: C-08593; DIGIKEY: S1011EC-02-ND; NOT_COMPONENT: YES; SEEED: 320020016; TH_PAD: 2
Y1 = mylib:OSC4_*; DIGIKEY: CTX974CT-ND; SMD_PAD: 4

## Board
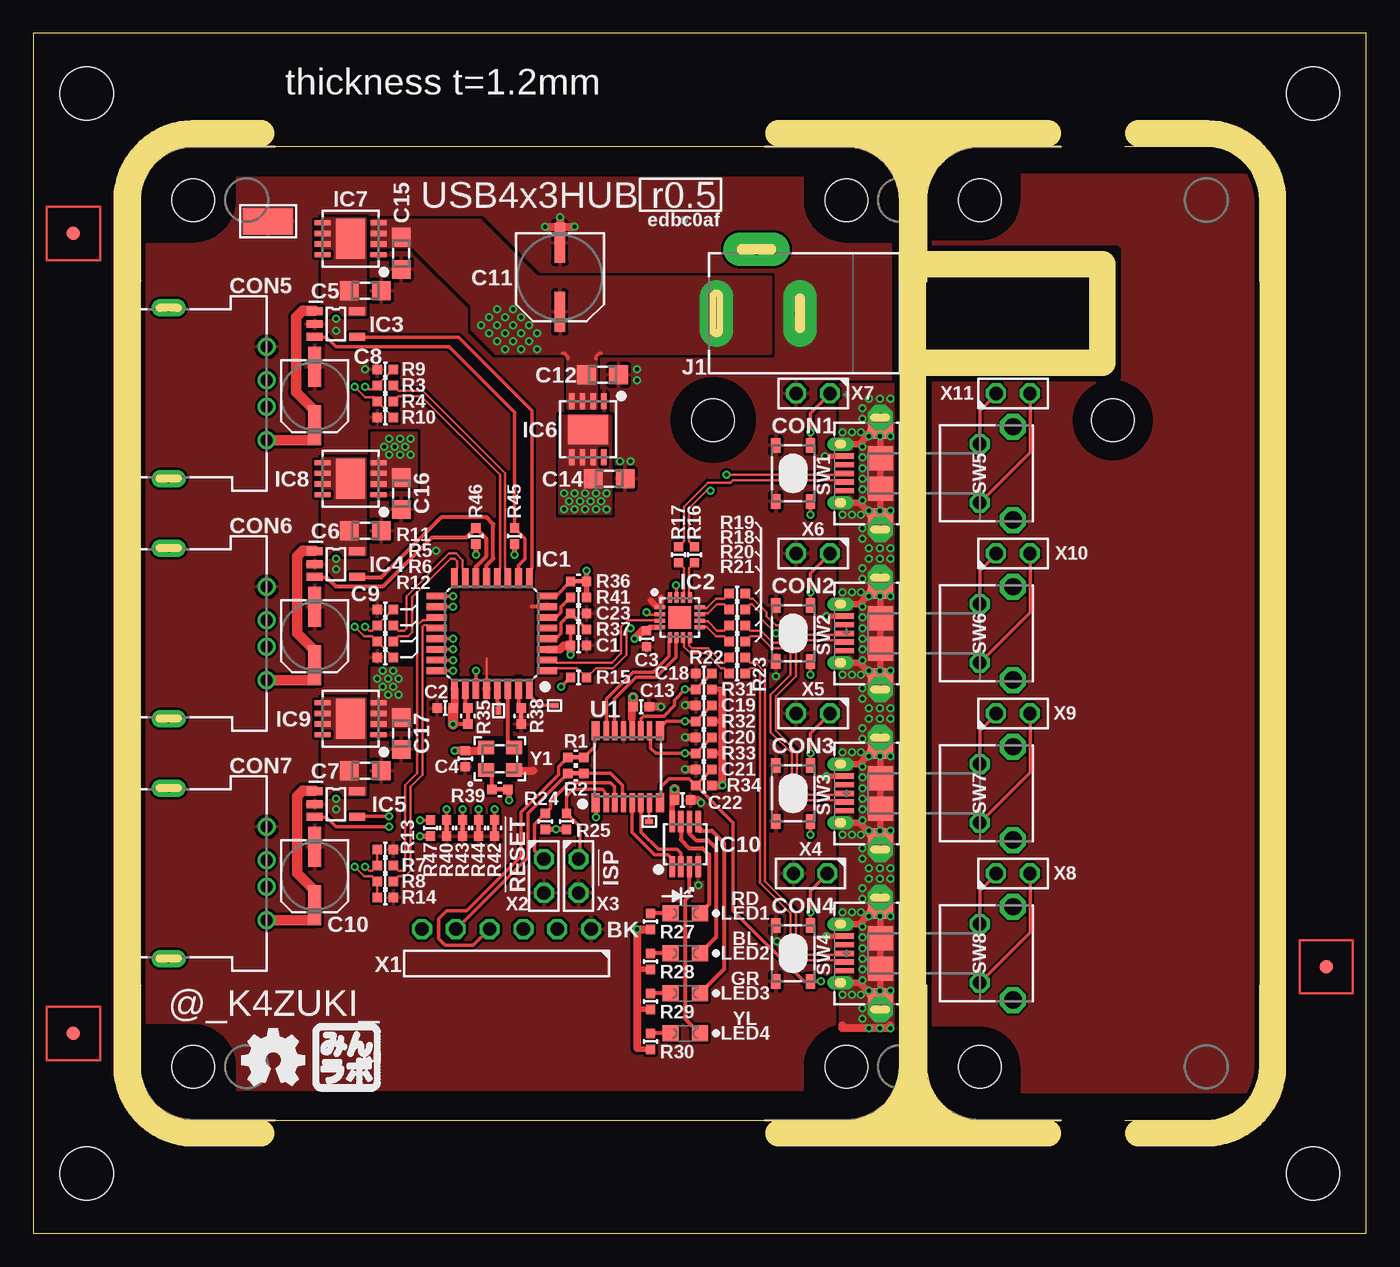
[diagram p2: board, top side]
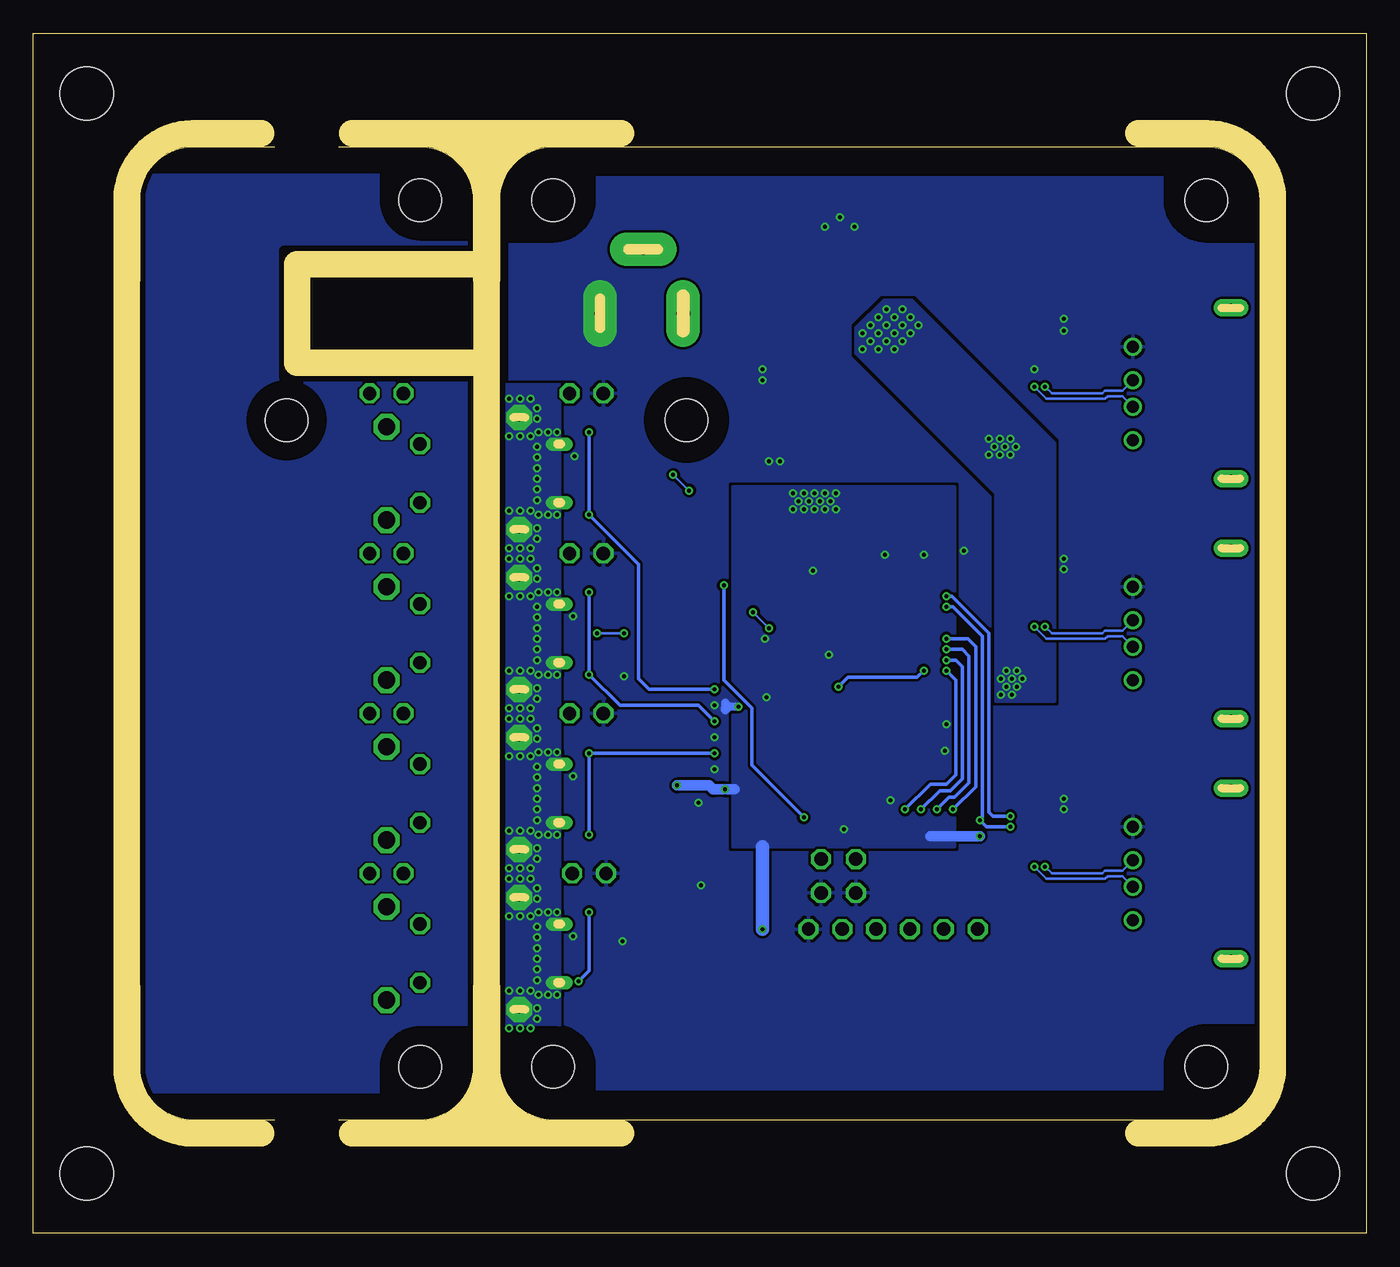
[diagram p3: board, bottom side, seen from below]

Size 100 x 90 mm. Coordinates in mm from the lower left corner, seen from the top.
Outline: 8,71.4 8,18.6
Outline: 54.9,81.5 17.6,81.5
Outline: 17.6,8.5 54.9,8.5
Outline: 0,0 100,0 100,90 0,90 0,0
Copper layers (1*16): Top 0.035mm / dielectric 1.5mm / Bottom 0.035mm
Design rules "default *": minimum track width 0.15mm, minimum drill 0.3mm, track to track 0.15mm, track to pad 0.15mm, pad to pad 0.15mm, via to via 0.15mm, smd to smd 0mil, copper to edge 0.4mm, drill to drill 8mil, minimum pad ring 0.15mm, minimum via ring 0.15mm, stop-mask expansion 0.05mm, vias tented up to drill 100mil, thermal gap 10mil
Holes 4 mm at 4,4.5 4,85.5 96,85.5 96,4.5
Holes 3.2 mm at 51,61 81,61
tKeepout: 2 lines
tRestrict: area 33.1,34.1 to 36.9,37.1; area 48,58 to 54,64; area 78,58 to 84,64; area 66,64.5 to 81,73.5; area 68,9.5 to 74,15.5; area 68,74.5 to 74,80.5; area 67,74.5 to 71,81.5; area 67,77.5 to 74,81.5; area 68,9.5 to 74,15.5; area 67,8.5 to 74,12.5; area 67,8.5 to 71,15.5; 17 lines
bRestrict: area 48,58 to 54,64; area 78,58 to 84,64; area 66,64.5 to 81,73.5; area 68,9.5 to 74,15.5; area 68,74.5 to 74,80.5; area 67,77.5 to 74,81.5; area 67,74.5 to 71,81.5; area 68,9.5 to 74,15.5; area 67,8.5 to 71,15.5; area 67,8.5 to 74,12.5; 8 lines
Milling: 13 lines

### Footprints (pad centres in the part's own frame; a part is rotated, then mirrored left to right if it is on the bottom)
C0402 = smd 0.7 x 0.7: 1 -0.6,0; 2 0.6,0
CR_2125 = smd 1.4 x 1.4: 1 -1.2,0; 2 1.2,0
C_2.5PHI5_875105142005WURTH = smd 1 x 3: + 0,-2.2; - 0,2.2
C_2.5PHI6.3_C6 = smd 0.8 x 3: + 0,-2.6; - 0,2.6
CON_USB_47589-0001MOLEX = smd 0.4 x 1.4: 1 -1.3,4.15; 2 -0.65,4.15; 3 0,4.15; 4 0.65,4.15; 5 1.3,4.15 | drill 0.6 pad 1 long: SHD -2.2,4.45; SHD$1 2.2,4.45 | drill 0.6 pad 1.9 octagon: SHD$2 -4.2,1.45; SHD$3 4.2,1.45 | smd 1.6 x 1.9: SHD$4 -3.4,1.45; SHD$7 3.4,1.45 | smd 1.8 x 1.9: SHD$5 -1.15,1.45; SHD$6 1.15,1.45
CON_USB_614104150121WURTH = drill 0.9: 1 3.5,0; 2 1,0; 3 -1,0; 4 -3.5,0 | drill 0.6 pad 1.3 long: SHLD -6.4,-7.35; SHLD@1 6.4,-7.35
QFP32_0.8P7.2X7.2 = smd 1.5 x 0.5: 1 -4.15,2.8; 2 -4.15,2; 3 -4.15,1.2; 4 -4.15,0.4; 5 -4.15,-0.4; 6 -4.15,-1.2; 7 -4.15,-2; 8 -4.15,-2.8; 17 4.15,-2.8; 18 4.15,-2; 19 4.15,-1.2; 20 4.15,-0.4; 21 4.15,0.4; 22 4.15,1.2; 23 4.15,2; 24 4.15,2.8 | smd 0.5 x 1.5: 9 -2.8,-4.15; 10 -2,-4.15; 11 -1.2,-4.15; 12 -0.4,-4.15; 13 0.4,-4.15; 14 1.2,-4.15; 15 2,-4.15; 16 2.8,-4.15; 25 2.8,4.15; 26 2,4.15; 27 1.2,4.15; 28 0.4,4.15; 29 -0.4,4.15; 30 -1.2,4.15; 31 -2,4.15; 32 -2.8,4.15
QFN16_0.5P3.0X3.0 = smd 0.8 x 0.3: 1 -1.5,0.75; 2 -1.5,0.25; 3 -1.5,-0.25; 4 -1.5,-0.75; 9 1.5,-0.75; 10 1.5,-0.25; 11 1.5,0.25; 12 1.5,0.75 | smd 0.3 x 0.8: 5 -0.75,-1.5; 6 -0.25,-1.5; 7 0.25,-1.5; 8 0.75,-1.5; 13 0.75,1.5; 14 0.25,1.5; 15 -0.25,1.5; 16 -0.75,1.5 | smd 1.7 x 1.7: DP 0,0
IC_05_0.95_50MIL = smd 0.6 x 1.2: 1 -0.95,-1.6; 2 0,-1.6; 3 0.95,-1.6; 4 0.95,1.6; 5 -0.95,1.6
DFN80P410X410_8N = smd 0.4 x 1.2: 1 -1.2,-2.1; 2 -0.4,-2.1; 3 0.4,-2.1; 4 1.2,-2.1; 5 1.2,2.1; 6 0.4,2.1; 7 -0.4,2.1; 8 -1.2,2.1 | smd 3 x 2.2: EP 0,0
SOT65P315X290-8N = smd 0.4 x 1.6: 1 -0.975,-1.7; 2 -0.325,-1.7; 3 0.325,-1.7; 4 0.975,-1.7; 5 0.975,1.7; 6 0.325,1.7; 7 -0.325,1.7; 8 -0.975,1.7
CON_DCJACK_C-1604 = drill 0.8 pad 2.5 long: 1 7.5,0; 2 10.75,-4.8 | drill 1 pad 2.5 long: 3 13.75,0
CHIPLED_0805 = smd 1.2 x 1.2: A 0,-1.1; C 0,1.1
PCB_CORNER = hole 3.2: 0,0
R0402SHORT = smd 0.7 x 0.7: 1 -0.6,0; 3 0.6,0 | smd 0.8 x 0.3: 2 0,0
SW_TACTSW_SKRPACE010 = smd 1.1 x 0.7: 1 -2.1,1.3; 2 2.1,1.3; 3 -2.1,-1.3; 4 2.1,-1.3
SW_TACTSW_TL1105S = drill 1 octagon: 1 -2.2,0; 2 2.2,0 | drill 1.3 octagon: P$1 -3.5,2.5; P$2 3.5,2.5
TP_4020 = smd 3.8 x 2: TP 0,0
TP06RECT = smd 0.4 x 0.6: TP 0,0
FIDUCIAL = smd 1 x 1: TP 0,0
SOT65P510X450X110-16N = smd 0.6 x 1.4: 1 -2.425,-2.7; 8 2.425,-2.7; 9 2.425,2.7; 16 -2.425,2.7 | smd 0.4 x 1.4: 2 -1.625,-2.7; 3 -0.975,-2.7; 4 -0.325,-2.7; 5 0.325,-2.7; 6 0.975,-2.7; 7 1.625,-2.7; 10 1.625,2.7; 11 0.975,2.7; 12 0.325,2.7; 13 -0.325,2.7; 14 -0.975,2.7; 15 -1.625,2.7
TSW-106-02-S-S-RA = drill 1 pad 1.5 octagon: 1 6.35,1.524; 2 3.81,1.524; 3 1.27,1.524; 4 -1.27,1.524; 5 -3.81,1.524; 6 -6.35,1.524
TSW-102-02-S-S = drill 1 pad 1.5 octagon: 1 1.27,0; 2 -1.27,0
CLOCK_2520 = smd 1.2 x 1: 1 -1.05,-0.85; 2 1.05,-0.85; 3 1.05,0.85; 4 -1.05,0.85

### Placement (x,y rotation side)
C1  40.9,44.1 0 top
C2  30.9,39.4 180 top
C3  46,44.6 270 top
C4  32.4,35.6 270 top
C5  24.9,70.7 0 top
C6  24.9,52.7 0 top
C7  24.9,34.7 0 top
C8  21.1,62.8 0 top
C9  21.1,44.8 0 top
C10  21.1,26.8 0 top
C11  39.5,71.7 0 top
C12  42.7,64.4 0 top
C13  45.6,39.5 180 top
C14  43.2,56.6 0 top
C15  27.6,73.5 270 top
C16  27.6,55.5 270 top
C17  27.6,37.5 270 top
C18  50.3,42 180 top
C19  50.3,39.6 180 top
C20  50.3,37.2 180 top
C21  50.3,34.8 180 top
C22  48.7,32.5 0 top
C23  40.9,46.5 0 top
CON1  65,57 90 top
CON2  65,45 90 top
CON3  65,33 90 top
CON4  65,21 90 top
CON5  17.5,63 270 top
CON6  17.5,45 270 top
CON7  17.5,27 270 top
GIT1  48.8,76 0 top
I1  21,10.7 0 top
IC1  34.4,45 180 top
IC2  48.5,46.2 0 top
IC3  22.7,68.2 270 top
IC4  22.7,50.2 270 top
IC5  22.7,32.2 270 top
IC6  41.6,60.3 180 top
IC7  23.8,74.6 90 top
IC8  23.8,56.6 90 top
IC9  23.8,38.6 90 top
IC10  48.9,29.2 0 top
ICON1  18,13 0 top
ICON2  48.8,77.9 0 top
J1  65,69 180 top
LED1  48.9,24 270 top
LED2  48.9,21 270 top
LED3  48.9,18 270 top
LED4  48.9,15 270 top
P1  12,12.5 270 top
P2  12,77.5 180 top
P3  61,77.5 90 top
P4  61,12.5 0 top
P5  71,77.5 180 top
P6  71,12.5 270 top
P7  88,12.5 0 top
P8  88,77.5 90 top
R1  40.7,35.7 0 top
R2  40.7,34.5 0 top
R3  26.4,63.6 180 top
R4  26.4,62.4 180 top
R5  26.4,45.6 180 top
R6  26.4,44.4 180 top
R7  26.4,27.6 180 top
R8  26.4,26.4 180 top
R9  26.4,64.8 0 top
R10  26.4,61.2 0 top
R11  26.4,46.8 0 top
R12  26.4,43.2 0 top
R13  26.4,28.8 180 top
R14  26.4,25.2 180 top
R15  40.9,41.7 180 top
R16  49.6,50.9 270 top
R17  48.4,50.9 270 top
R18  52.8,46.8 180 top
R19  52.8,48 180 top
R20  52.8,45.6 180 top
R21  52.8,44.4 180 top
R22  52.8,43.2 180 top
R23  52.8,42 180 top
R24  38.4,30.9 270 top
R25  40,30.9 270 top
R27  46.3,23.4 270 top
R28  46.3,20.4 270 top
R29  46.3,17.4 270 top
R30  46.3,14.4 270 top
R31  50.3,40.8 0 top
R32  50.3,38.4 0 top
R33  50.3,36 0 top
R34  50.3,33.6 0 top
R35  32.6,38.8 90 top
R36  40.9,48.9 180 top
R37  40.9,45.3 0 top
R38  36.6,38.8 90 top
R39  35,33.3 180 top
R40  31,30.4 90 top
R41  40.9,47.7 0 top
R42  34.6,30.4 90 top
R43  32.2,30.4 90 top
R44  33.4,30.4 90 top
R45  36.1,52.3 270 top
R46  33.2,52.3 270 top
R47  29.8,30.4 270 top
SW1  57,57 90 top
SW2  57,45 90 top
SW3  57,33 90 top
SW4  57,21 90 top
SW5  71,57 270 top
SW6  71,45 270 top
SW7  71,33 270 top
SW8  71,21 270 top
TP1  17.6,75.9 180 top
TP3  34.9,39.2 180 top
TP4  46.2,30.9 90 top
TP5  39.1,39.6 90 top
TP100  3,15 0 top
TP101  97,20 0 top
TP102  3,75 0 top
U1  44.6,35 0 top
X1  35.5,21.3 0 top
X2  38.3,26.8 90 top
X3  40.9,26.8 90 top
X4  58.3,27 0 top
X5  58.5,39 0 top
X6  58.5,51 0 top
X7  58.5,63 0 top
X8  73.5,27 180 top
X9  73.5,39 180 top
X10  73.5,51 180 top
X11  73.5,63 180 top
Y1  35,35.6 0 top

### Tracks (layer width: path | path; a pad name or v marks a point on that pad's centre or on a via)
3.3V  (via drill 0.3)
  Top 0.25: R37.1 C1.1 | R36.1 R36.2
  Top 0.3: v31.5,38.2 R35.1 R35.2 | U1.12 44.92,38.17 44.9,38.2 44.9,38.6 | R39.1 R39.2
  Top 0.4: IC10.8 47.92,32.33 C22.1 | R24.2 v39.2,30.3 R25.2 | R39.1 35.7,33.2 v35.7,32.5 | v41.5,49.7 R36.1 R41.2 | R45.2 v36.1,50.9 | v29,29.8 R47.2 | R46.2 v33.2,50.9 | R33.2 51.7,36 | R32.2 51.7,38.4 | R31.2 51.7,40.8 51.7,40.7 | IC2.4 46.25,45.45 C3.1 | 45.3,13.9 45.3,13.8 R30.2 | R29.2 45.3,16.8 | R28.2 45.3,19.8
  Top 0.6: IC1.25 31.6,39.5 C2.1 | R27.2 v45.3,22.8 45.3,19.8 45.3,16.8 45.3,13.9 | 44.9,38.6 44.9,39.4 C13.2 | v31.6,36.2 C4.1 33.7,36.2 Y1.4 | 51.7,40.7 51.7,38.4 51.7,36 v51.7,33.6 R34.2 | v40.3,43.4 C1.1 39.8,44.1 39.5,43.8 IC1.3 | C3.1 45.7,45.2 v45.1,44.6
  Top 0.8: v31.5,38.2 C2.1 | v45,40.2 C13.2 | v48.1,33.3 C22.1
  Bottom 0.8: 47.4,33.3 v48.1,33.3 49,33.3 49.3,33.6 v51.7,33.6 | v29,29.8 32.7,29.8
  Bottom 1: v45.3,22.8 45.3,29
  other vias: 43,54.3 39.8,54.3 40.2,54.9 41,54.9 41.8,54.9 39.8,55.5 42.6,54.9 41.4,54.3 40.6,55.5 41.4,55.5 42.2,55.5 42.2,54.3 40.6,54.3 43,55.5
  pour Bottom (isolate 0.2, rank 2): 30.9,56 47.5,56 47.5,29 30.9,29
  pour Top (isolate 0.2, rank 2, no thermals): 39.5,61.3 43.3,61.3 43.3,54 39.5,54
5V1
  pour Top (isolate 0.2, rank 2, no thermals): 21.7,76.1 24.9,76.1 24.9,68.9 21.7,68.9
5V2
  pour Top (isolate 0.2, rank 2, no thermals): 21.7,58.1 24.9,58.1 24.9,50.9 21.7,50.9
5V3
  pour Top (isolate 0.2, rank 2, no thermals): 21.7,40.1 24.9,40.1 24.9,32.9 21.7,32.9
!OE!  (via drill 0.3)
  Top 0.2: U1.1 42.17,32.23 42.2,32.2
  Top 0.25: IC2.15 48.25,48.55 v48.2,48.6 | 42.2,32.2 v42.2,31.2
  Bottom 0.25: v48.2,48.6 48.2,41.5 46.1,39.4 46.1,35.1 v42.2,31.2
!RESET!
  Top 0.2: X2.1 38.23,28.07 38.2,28.1
  Top 0.25: U1.3 43.6,32.3 43.6,33.5 43.3,33.8 40.2,33.8 38.8,32.4 38.8,31.9 R24.1 37.6,30.7 37.6,28.7 38.2,28.1
->TX
  Top 0.25: X1.4 33,21.6 30.9,21.6 30.4,22.1 30.4,23.6 31,24.2 32.5,24.2 36.6,28.3 36.6,31.6 39.4,34.4 39.4,35 R1.1 R1.2
<-RX
  Top 0.25: X1.5 31.72,22.82 31.8,22.9 31.8,23.1 32,23.1 37.1,28.2 37.1,31.5 R2.1 R2.2
GND  (via drill 0.3)
  Top 0.2: 34,40.5 34,43.1
  Top 0.3: IC1.7 37.4,47
  Top 0.4: 46.3,47.5 46.8,47 47.1,47 47.1,47.7 | v59.4,58.3 CON1.5 | v59.5,46.3 CON2.5 | v59.5,34.3 CON3.5 | v59.5,22.3 CON4.5
  Top 0.6: v47.1,39.5 C13.1 | Y1.2 36.1,34.7 37.5,34.7 | C19.2 v48.9,39.6 | v38.4,75.5 39.5,75.5 | 39.5,75.5 v40.6,75.5 | v39.5,76.2 39.5,75.5 | v50.1,32.3 49.9,32.5 49.4,32.5 | v48.9,34.8 C21.2 | v48.9,37.2 C20.2
  Bottom 0.6: v47.1,39.5 47.8,39.5 | 47.8,39.5 48.1,39.5 | 47.8,39.5 48.1,39.8 48.1,39.5 | 47.8,39.5 48.1,39.2 48.1,39.5
  other vias: 49.9,26.1 45.3,64.8 45.3,64 44.8,57.9 44,57.9 22.7,50.6 22.7,49.8 22.7,68.6 22.7,67.7 22.7,32.6 22.7,31.8 24.9,64.8 30.2,51.2 55.7,41.8 55.8,21.9
  pour Top (isolate 0.2, rank 5): 8,81.5 65,81.5 65,8.5 8,8.5
  pour Bottom (isolate 0.2, rank 5): 8,81.5 92,81.6 92,8.5 8,8.5
ISP
  Top 0.2: U1.2 42.9,32.3 | X3.1 40.9,28.1 41,28.1
  Top 0.25: 41,28.1 41,30.5 R25.1 40,32.8 40.5,33.3 42.7,33.3 42.9,33.1 42.9,32.3
LSEL1
  Top 0.25: IC10.1 47.92,28.07 47.6,28.4 46.6,28.4 44.9,30.1 44.9,32.3 U1.5
LSEL2
  Top 0.25: U1.6 45.6,32.3 45.6,30.1 46.9,28.8 48.3,28.8 48.6,28.5 48.6,27.5 IC10.2
N$1  (via drill 0.3)
  Top 0.2: IC2.2 46.85,46.45 46.8,46.4 46.2,46.4 v46,46.6 | IC1.1 39.1,42.2 39.3,42.4 40.8,42.4 R15.1 42.2,42.4 43.5,42.4 44.5,43.4 44.5,45.1 v44.8,45.4
  Bottom 0.2: v46,46.6 v44.8,45.4
N$2
  Top 0.2: IC2.3 46.75,45.95 46.7,46 44.6,46 44.1,45.5 44.1,43.5 43.4,42.8 39.3,42.8 39.1,43 IC1.2
N$3  (via drill 0.3)
  Top 0.2: CON1.3 60.5,57 60.4,56.9 v52,56.9 | R16.1 49.2,51.9 49.2,54.4 50.5,55.7 v50.8,55.7
  Bottom 0.2: v50.8,55.7 v52,56.9
N$4
  Top 0.2: CON1.2 60.55,56.35 60.4,56.5 52.5,56.5 52.3,56.3 50.6,56.3 48.8,54.5 48.8,51.9 R17.1
N$5  (via drill 0.3)
  Top 0.2: CON2.3 60.5,45 60.4,44.9 57.8,44.9 v57.7,45 | R18.1 53.8,47.2 53.9,47.2 54.6,46.5 54.6,46.1 v55.7,45
  Bottom 0.2: v55.7,45 v57.7,45
N$6
  Top 0.2: CON2.2 60.55,44.35 60.4,44.5 58,44.5 57.9,44.4 57.2,44.4 56,45.6 55.7,45.6 55,46.3 55,46.6 54,47.6 53.8,47.6 R19.1
N$7
  Top 0.2: CON3.3 60.5,33 60.4,32.9 58.2,32.9 57.3,33.8 57.3,36.1 55.7,37.7 55.7,40.3 57.2,41.8 57.2,43.8 56.7,44.3 55.5,44.3 54.6,45.2 53.8,45.2 R20.1
N$8
  Top 0.2: CON4.3 60.5,21 60.4,20.9 57.6,20.9 57.2,21.3 57.2,24.1 54.9,26.4 54.9,42.1 54.2,42.8 53.8,42.8 R22.1
N$9
  Top 0.2: CON3.2 60.55,32.35 60.4,32.5 58.1,32.5 56.9,33.7 56.9,36 55.3,37.6 55.3,40.4 56.8,41.9 56.8,43.5 56.4,43.9 55.4,43.9 54.5,44.8 53.8,44.8 R21.1
N$10
  Top 0.2: CON4.2 60.55,20.35 60.4,20.5 57.5,20.5 56.8,21.2 56.8,24 54.5,26.3 54.5,42 54.1,42.4 53.8,42.4 R23.1
N$11
  Top 0.2: IC3.1 21.1,69.2
  Top 0.8: CON5.1 21.1,59.5 C8.+ 21.1,61.7 19.7,63.1 19.7,68.7 20.2,69.2 21.1,69.2
N$12
  Top 0.2: IC4.1 21.1,51.2
  Top 0.8: 21.1,51.2 20.2,51.2 19.8,50.8 19.8,45 21.1,43.7 C9.+ 21.1,41.5 CON6.1
N$13
  Top 0.2: IC5.1 21.1,33.2
  Top 0.8: 21.1,33.2 20.2,33.2 19.8,32.8 19.8,27 21.1,25.7 C10.+ 21.1,23.5 CON7.1
N$15
  Top 0.3: IC1.30 35.6,36.9 Y1.3
N$16
  Top 0.25: IC1.10 36.4,50.1 36.9,50.6 36.9,52.1 R45.1 36.1,61.6 31.2,66.5 22.7,66.5 22,67.2 21.1,67.2
  Top 0.3: IC3.3 21.1,67.2
N$17
  Top 0.25: IC1.9 37.2,49.7 37.4,49.9 37.4,61.7 31.9,67.2 24.3,67.2 IC3.4
N$18  (via drill 0.3)
  Top 0.2: R9.2 R3.2 25.5,63.3 25.1,63.3 v24.9,63.5
  Bottom 0.2: CON5.2 18.3,62.8 19.4,62.8 19.6,62.6 24,62.6 v24.9,63.5
N$19  (via drill 0.3)
  Top 0.2: R10.2 R4.2 25.5,62.7 24.9,62.7 v24.1,63.5
  Bottom 0.2: CON5.3 18.3,63.2 19.6,63.2 19.8,63 23.6,63 v24.1,63.5
N$20
  Top 0.3: IC1.14 33.2,50 34,50.8 34,52.1 R46.1 32.5,52.2 29.9,52.2 26.2,48.5 22.7,48.5 22,49.2 21.1,49.2 IC4.3
N$21
  Top 0.3: IC1.13 34,50.1 34.5,50.6 34.5,53.2 34,53.7 30.6,53.7 26.1,49.2 24.3,49.2 IC4.4
N$22  (via drill 0.3)
  Top 0.2: R11.2 R5.2 25.4,45.2 25.2,45.2 v24.9,45.5
  Bottom 0.2: CON6.2 18.3,44.8 19.4,44.8 19.6,44.6 24,44.6 v24.9,45.5
N$23  (via drill 0.3)
  Top 0.2: R12.2 R6.2 25.4,44.8 24.8,44.8 v24.1,45.5
  Bottom 0.2: CON6.3 18.3,45.2 19.6,45.2 19.8,45 23.6,45 v24.1,45.5
N$24  (via drill 0.3)
  Top 0.25: IC1.17 v31.5,47.8 | IC5.4 24.3,31.3 v26.7,31.3
  Bottom 0.25: v31.5,47.8 31.1,47.8 28.3,45 28.3,31.6 28,31.3 v26.7,31.3
N$25  (via drill 0.3)
  Top 0.25: IC1.18 v31.5,47 | R47.1 v29,31 | IC5.3 21.1,31.2 22,31.2 22.7,30.5 v26.7,30.5
  Bottom 0.25: v31.5,47 31,47 28.8,44.8 28.8,31.2 v29,31 28.5,30.5 v26.7,30.5
N$26  (via drill 0.3)
  Top 0.2: R13.2 R7.2 25.4,27.2 25.2,27.2 v24.9,27.5
  Bottom 0.2: v24.9,27.5 24,26.6 19.6,26.6 19.4,26.8 18.3,26.8 CON7.2
N$27  (via drill 0.3)
  Top 0.2: R14.2 R8.2 25.4,26.8 24.8,26.8 v24.1,27.5
  Bottom 0.2: v24.1,27.5 23.6,27 19.8,27 19.6,27.2 18.3,27.2 CON7.3
N$30
  Top 0.25: IC1.6 39.2,46.2 39.6,46.6 39.6,47 R41.1
N$35
  Top 0.2: R3.1 27.4,63.2 29.2,63.2 35.4,57 35.4,49.9 35.6,49.7 IC1.11
N$36
  Top 0.2: R4.1 27.4,62.8 29.1,62.8 35,56.9 35,49.9 34.8,49.7 IC1.12
N$37
  Top 0.2: R5.1 27.4,45.2 27.8,45.2 28,45.4 28,47.8 31.2,51 31.7,51 32.2,50.5 32.2,49.9 32.4,49.7 IC1.15
N$38
  Top 0.2: R6.1 27.4,44.8 28.1,44.8 28.4,45.1 28.4,47.7 31.3,50.6 31.6,50.6 31.8,50.4 31.8,49.9 31.6,49.7 IC1.16
N$39
  Top 0.2: IC1.19 29.7,46.2 29.5,46 29.2,46 28.8,45.6 28.8,34.5 27.9,33.6 27.9,27.3 27.8,27.2 27.4,27.2 R7.1
N$40
  Top 0.2: R8.1 27.4,26.8 27.9,26.8 28.3,27.2 28.3,33.5 29.2,34.4 29.2,45.5 29.3,45.6 29.5,45.6 29.7,45.4 IC1.20
N$41  (via drill 0.3)
  Top 0.25: R15.2 v39.6,41 | v33.2,42.2 IC1.27
  Bottom 0.25: v39.6,41 38.9,41.7 33.7,41.7 v33.2,42.2
N$42
  Top 0.2: R16.2 49.2,49.9 49.2,48 49.25,47.95 IC2.13
N$43
  Top 0.2: IC2.11 50.25,46.45 50.3,46.5 50.6,46.5 51.3,47.2 51.8,47.2 R18.2
N$44
  Top 0.2: IC2.10 50.25,45.95 50.3,45.9 50.6,45.9 51.3,45.2 51.8,45.2 R20.2
N$45
  Top 0.2: IC2.8 49.25,44.45 49.2,44.4 49.2,44.1 49.4,43.9 50.6,43.9 51.7,42.8 51.8,42.8 R22.2
N$46
  Top 0.2: R17.2 48.8,49.9 48.8,48 48.75,47.95 IC2.14
N$47
  Top 0.2: IC2.12 50.25,46.95 50.3,46.9 50.5,46.9 51.2,47.6 51.8,47.6 R19.2
N$48
  Top 0.2: IC2.9 50.25,45.45 50.3,45.5 50.5,45.5 51.2,44.8 51.8,44.8 R21.2
N$49
  Top 0.2: IC2.7 48.75,44.45 48.8,44.4 48.8,44 49.3,43.5 50.5,43.5 51.6,42.4 51.8,42.4 R23.2
N$50
  Top 0.25: IC1.32 37.2,40.4 38,39.6 TP5.TP
N$51
  Top 0.3: IC10.7 48.58,29.52 49.2,28.9 50.2,28.9 50.7,28.4 50.7,24.7 LED1.C
N$52
  Top 0.3: IC10.6 49.23,29.98 49.7,29.5 50.6,29.5 51.2,28.9 51.2,22.2 LED2.C
N$53
  Top 0.3: IC10.5 49.9,30.9 49.9,30.5 | 49.9,30.5 49.9,30.2 50.2,30.2 | 50.2,30.2 50.9,30.2 51.8,29.3 51.8,19.8 LED3.C | 49.9,30.5 50.2,30.2
N$54
  Top 0.3: IC10.3 49.23,27.43 49.2,27.4 49.2,25.3 48.9,25 48.9,16.1 LED4.C
N$55
  Top 0.3: LED4.A R30.1
N$56
  Top 0.3: LED3.A R29.1
N$57
  Top 0.3: LED2.A R28.1
N$58
  Top 0.3: LED1.A R27.1
N$59
  Top 0.3: IC1.29 34.8,39.9 34.9,39.8 TP3.TP
N$60
  Top 0.3: IC1.26 32.4,39.6 R35.3
N$61
  Top 0.25: IC1.8 39.2,47.8 R36.3
N$62
  Top 0.25: IC1.4 39.2,44.6 39.6,45 39.6,45.8 C23.1 R37.2
N$63  (via drill 0.3)
  Top 0.25: IC1.21 v31.5,44.6 | R40.3 v31,31.8
  Bottom 0.25: v31.5,44.6 29.9,44.6 29.3,44 29.3,33.5 v31,31.8
N$64
  Top 0.3: IC1.31 36.4,39.6 R38.3
N$65  (via drill 0.3)
  Top 0.25: R43.3 v32.2,31.8 | IC1.22 v31.5,43.8
  Bottom 0.25: v31.5,43.8 30.3,43.8 29.8,43.3 29.8,33.8 30.9,32.7 31.3,32.7 v32.2,31.8
N$66  (via drill 0.3)
  Top 0.25: R44.3 v33.4,31.8 | IC1.23 v31.5,43
  Bottom 0.25: v31.5,43 30.8,43 30.3,42.5 30.3,34.1 31.2,33.2 32,33.2 v33.4,31.8
N$67  (via drill 0.3)
  Top 0.25: IC1.24 v31.5,42.2 | R42.3 v34.6,31.8
  Bottom 0.25: v31.5,42.2 30.8,41.5 30.8,34.4 31.5,33.7 32.7,33.7 v34.6,31.8
N$68
  Top 0.3: R39.3 34.4,34.3 Y1.1
N$69
  Top 0.2: TP4.TP 46.2,32.2 46.23,32.23 U1.7
N$73
  pour Bottom: 67,81.5 92,81.5 92,8.5 67,8.5
  pour Top: 67,81.5 92,81.5 92,8.5 67,8.5
N$74
  Top 0.25: SW8.2 74.8,22.6 74.8,26.9 74.9,26.9 74.9,27 X8.2
N$75
  Top 0.25: SW7.2 74.8,34.6 74.8,38.9 74.9,38.9 74.9,39 X9.2
N$76
  Top 0.25: SW6.2 74.8,46.6 74.8,50.9 74.9,50.9 74.9,51 X10.2
N$77
  Top 0.25: SW5.2 74.8,58.6 74.8,62.9 74.9,62.9 74.9,63 X11.2
SEL0
  Top 0.25: IC2.6 48.25,44.45 48.2,44.4 48.2,43.2 46.7,41.7 45.2,41.7 43.6,40.1 43.6,38.3 43.62,38.27 U1.14
SEL1
  Top 0.25: IC2.5 47.75,44.45 47.7,44.4 47.7,43.3 46.5,42.1 45,42.1 43,40.1 43,38.3 42.98,38.27 U1.15
SHIELD  (via drill 0.3)
  Top 0.5: CON1.SHD 62.05,54.8 CON1.SHD$2 CON1.SHD$4 CON1.SHD$5 CON1.SHD$6 CON1.SHD$7 CON1.SHD$3 62.05,59.2 CON1.SHD$1 | CON2.SHD 62.05,42.8 CON2.SHD$2 CON2.SHD$4 CON2.SHD$5 CON2.SHD$6 CON2.SHD$7 CON2.SHD$3 62.05,47.2 CON2.SHD$1 | CON3.SHD 62.05,30.8 CON3.SHD$2 CON3.SHD$4 CON3.SHD$5 CON3.SHD$6 CON3.SHD$7 CON3.SHD$3 62.05,35.2 CON3.SHD$1 | CON4.SHD$1 62.05,23.2 CON4.SHD$3 CON4.SHD$7 CON4.SHD$6 CON4.SHD$5 CON4.SHD$4 CON4.SHD$2 62.05,18.8 CON4.SHD
  Top 0.6: 64.3,15.6 v64.3,15.4 v62.7,15.4 60.7,15.4 60.7,15.6
  other vias: 64.3,62.6 63.5,62.6 63.5,59.8 64.3,59.8 62.7,62.6 62.7,59.8 60.7,60.1 61.4,60.1 62.1,60.1 62.2,61.9 62.2,61.1 60.7,53.9 61.4,53.9 62.1,53.9 64.3,54.2 63.5,54.2 62.7,54.2 64.3,51.4 63.5,51.4 62.7,51.4 62.2,52.1 62.2,52.9 64.3,50.6 63.5,50.6 62.7,50.6 62.2,59 62.2,58.2 62.2,57.4 62.2,56.6 62.2,55.8 62.2,55 62.2,49.9 62.2,49.1 64.3,47.8 63.5,47.8 62.7,47.8 60.7,48.1 61.4,48.1 62.1,48.1 60.7,41.9 61.4,41.9 62.1,41.9 64.3,42.2 63.5,42.2 62.7,42.2 64.3,39.4 64.3,38.6 63.5,38.6 63.5,39.4 62.7,38.6 62.7,39.4 62.2,40.9 62.2,40.1 62.2,37.1 62.2,37.9 62.2,47 62.2,46.2 62.2,45.4 62.2,44.6 62.2,43.8 62.2,43 64.3,35.8 63.5,35.8 62.7,35.8 60.7,36.1 61.4,36.1 62.1,36.1 60.7,29.9 61.4,29.9 62.1,29.9 64.3,30.2 63.5,30.2 62.7,30.2 62.2,35 62.2,34.2 62.2,33.4 62.2,32.6 62.2,31.8 62.2,31 64.3,27.4 64.3,26.6 63.5,26.6 63.5,27.4 62.7,26.6 62.7,27.4 62.2,28.9 62.2,28.1 62.2,25.1 62.2,25.9 64.3,23.8 63.5,23.8 62.7,23.8 60.7,24.1 61.4,24.1 62.1,24.1 60.7,17.9 61.4,17.9 62.1,17.9 64.3,18.2 63.5,18.2 62.7,18.2 62.2,23 62.2,22.2 62.2,21.4 62.2,20.6 62.2,19.8 62.2,19 63.5,15.4 62.2,16.9 62.2,16.1
  pour Top (no thermals): 65,63.7 65,15.6 60.5,15.6 60.5,63.7
  pour Bottom (no thermals): 65,63.7 65,15.6 60.5,15.6 60.5,63.7
SW1  (via drill 0.3)
  Top 0.2: U1.11 45.58,37.77 45.6,37.8
  Top 0.25: 45.6,37.8 45.6,38.6 45.8,38.8 47.3,38.8 48.1,39.6 48.1,40 v48.9,40.8 R31.1 C18.1 | SW1.3 v58.3,53.9 | SW1.4 v58.3,60.1 58.3,61.5 59.7,62.9 59.7,63 X7.1
  Bottom 0.25: v48.9,40.8 53.8,40.8 54.6,41.6 54.6,50.2 v58.3,53.9 v58.3,60.1
SW2  (via drill 0.3)
  Top 0.25: 47.02,37.67 U1.9 47.02,37.92 47.5,38.4 v48.9,38.4 R32.1 C19.1 | SW2.3 v58.3,41.9 | SW2.4 v58.3,48.1 58.3,49.5 59.7,50.9 59.7,51 X6.1
  Bottom 0.25: v48.9,38.4 50.1,39.6 56,39.6 v58.3,41.9 v58.3,48.1
SW3  (via drill 0.3)
  Top 0.2: U1.10 46.23,37.67 46.3,37.6
  Top 0.25: 46.3,37.6 46.3,36.4 46.7,36 v48.9,36 R33.1 C20.1 | SW3.4 v58.3,36 58.3,37.5 59.7,38.9 59.7,39 X5.1 | SW3.3 v58.3,29.9
  Bottom 0.25: v48.9,36 v58.3,36 v58.3,29.9
SW4  (via drill 0.3)
  Top 0.25: R34.1 49.2,34.1 47.7,34.1 47.1,33.5 47.1,32.3 U1.8 | R34.1 C21.1 | R34.1 52.5,30.8 52.5,24.2 57.8,18.9 SW4.3 v59.1,18.9 | SW4.4 v58.3,24.1 58.3,25.7 59.5,26.9 59.5,27 X4.1 59.6,27
  Bottom 0.25: v58.3,24.1 58.3,19.7 v59.1,18.9
SW5
  Top 0.25: X11.1 72.2,63 72.2,62.9 71,61.7 SW5.1
SW6
  Top 0.25: X10.1 72.2,51 72.2,50.9 71,49.7 SW6.1
SW7
  Top 0.25: X9.1 72.2,39 72.2,38.9 71,37.7 SW7.1
SW8
  Top 0.25: X8.1 72.2,27 72.2,26.9 71,25.7 SW8.1
TGT_RX
  Top 0.25: U1.16 42.1,37.7 42.1,36.5 R1.3
TGT_TX
  Top 0.25: R2.3 43.3,34.5 44.2,33.6 44.2,32.3 U1.4
VIN  (via drill 0.3)
  Top 0.25: 39.7,66 arc-90 40.1,65.6 | 42.2,65.6 arc-90 42.6,66
  other vias: 36.6,68.7 36,69.3 27.9,59 27.5,58.4 26.7,59.6 28.3,58.4 28.3,59.6 27.1,59 26.7,58.4 27.5,59.6 26.3,59 26.6,41.6 26.2,41 25.8,41.6 27.4,41.6 27.4,40.4 27,41 26.6,40.4 37.2,68.1 37.8,67.5 36.6,67.5 36,68.1 37.2,66.9 35.4,68.7 34.8,69.3 37.8,66.3 34.2,68.7 34.8,68.1 35.4,67.5 36,66.9 36.6,66.3 33.6,68.1 34.2,67.5 34.8,66.9 35.4,66.3 26.2,42.2 27,42.2
  pour Top (isolate 0.2): 34.7,66 32.9,67.8 32.9,69.6 28.5,74 28.5,76 33.5,76 37.68,71.82 arc45 37.97,71.7 55.3,71.7 55.3,66
  pour Top (isolate 0.2, no thermals): 40.1,66 40.1,61.9 42.2,61.9 42.2,66
  pour Bottom (isolate 0.2): 27.8,39.9 27.8,63.7 23.4,59.3 23.4,39.9
  pour Top (isolate 0.2, rank 2, no thermals): 25.4,56 25.4,60 28.7,60 28.7,56
  pour Top (isolate 0.2, rank 2, no thermals): 28.5,76 28.5,74 25.4,74 25.4,76
  pour Top (isolate 0.2, rank 2, no thermals): 25.4,38 25.4,42.4 28.7,42.4 28.7,38
  pour Bottom: 27.8,55.5 38.3,66 38.3,67.9 36.2,70 34.1,70 27.8,63.7

### Text on the board
tPlace: thickness t=1.2mm | USB4x3HUB | RD | BL | GR | !RESET! | !ISP! | RD | BK | BL | YL | GR | @_K4ZUKI_ | YL
Measures: h=10 | h=7.5 | h=3.0 | enclosure material t=1.5 / +) space=3.95 -> 4.0 / +) board t=1.2 / ---------------------------- / total '=, 6.5
tDocu: JUST in MXA2-8-7SS (TAKACHI)
Vscore: V-CUT | V-CUT